# EAGLE design ATBS_Evaluation-Board (EAGLE 9.7.0)

## Sheet 1 of 4
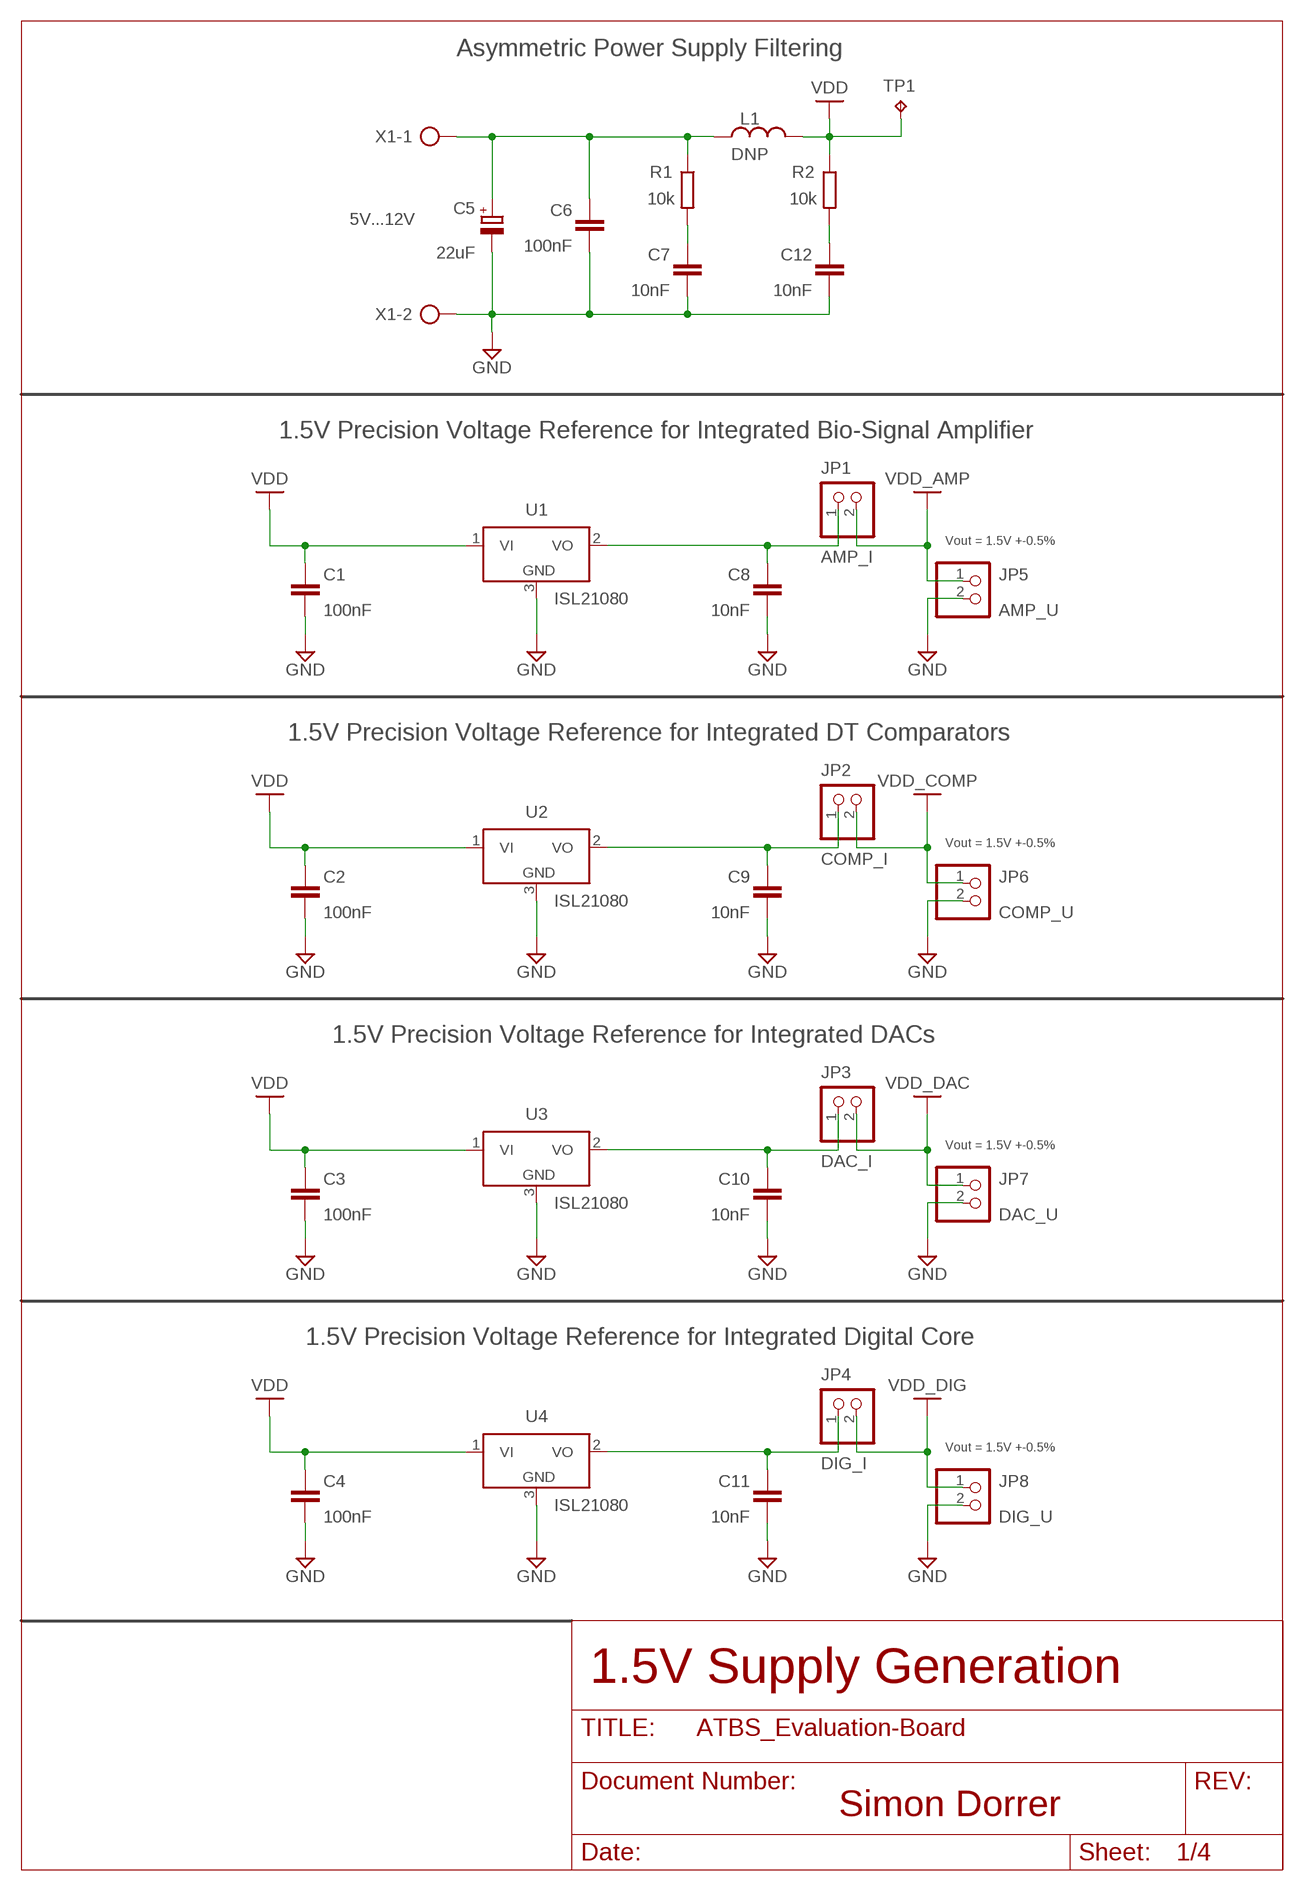
[diagram p0: schematic, sheet 1]

### Parts
C1  100nF  C_CHIP-0805(2012-METRIC)  [CAPC2012X110]
C2  100nF  C_CHIP-0805(2012-METRIC)  [CAPC2012X110]
C3  100nF  C_CHIP-0805(2012-METRIC)  [CAPC2012X110]
C4  100nF  C_CHIP-0805(2012-METRIC)  [CAPC2012X110]
C5  22uF  CPOL-EUSMCD  [SMC_D]
C6  100nF  C_CHIP-0805(2012-METRIC)  [CAPC2012X110]
C7  10nF  C_CHIP-0805(2012-METRIC)  [CAPC2012X110]
C8  10nF  C_CHIP-0805(2012-METRIC)  [CAPC2012X110]
C9  10nF  C_CHIP-0805(2012-METRIC)  [CAPC2012X110]
C10  10nF  C_CHIP-0805(2012-METRIC)  [CAPC2012X110]
C11  10nF  C_CHIP-0805(2012-METRIC)  [CAPC2012X110]
C12  10nF  C_CHIP-0805(2012-METRIC)  [CAPC2012X110]
JP1  AMP_I  PINHD-1X2  [1X02]
JP2  COMP_I  PINHD-1X2  [1X02]
JP3  DAC_I  PINHD-1X2  [1X02]
JP4  DIG_I  PINHD-1X2  [1X02]
JP5  AMP_U  PINHD-1X2  [1X02]
JP6  COMP_U  PINHD-1X2  [1X02]
JP7  DAC_U  PINHD-1X2  [1X02]
JP8  DIG_U  PINHD-1X2  [1X02]
L1  DNP  L_MOLDED(5450-METRIC)  [INDM5450X580]
R1  10k  R_CHIP-0805(2012-METRIC)  [RESC2012X65]
R2  10k  R_CHIP-0805(2012-METRIC)  [RESC2012X65]
TP1  TPPAD1-13  [P1-13]
U1  ISL21080  [SOT-23]
U2  ISL21080  [SOT-23]
U3  ISL21080  [SOT-23]
U4  ISL21080  [SOT-23]
X1  5V...12V  AK500/2  [AK500/2]

### Nets
GND: C1.2 C2.2 C3.2 C4.2 C5.- C6.2 C7.2 C8.2 C9.2 C10.2 C11.2 C12.2 JP5.2 JP6.2 JP7.2 JP8.2 U1.3(GND) U2.3(GND) U3.3(GND) U4.3(GND) X1.2 ; also sheet 2,3,4
N$1: C9.1 JP2.1 U2.2(VO)
N$2: C10.1 JP3.1 U3.2(VO)
N$3: C11.1 JP4.1 U4.2(VO)
N$30: C12.1 R2.2
N$38: C7.1 R1.2
N$42: C8.1 JP1.1 U1.2(VO)
N$47: C5.+ C6.1 L1.1 R1.1 X1.1
VDD [Supply]: C1.1 C2.1 C3.1 C4.1 L1.2 R2.1 TP1.TP U1.1(VI) U2.1(VI) U3.1(VI) U4.1(VI) ; also sheet 2
VDD_AMP [Supply]: JP1.2 JP5.1 ; also sheet 4
VDD_COMP [Supply]: JP2.2 JP6.1 ; also sheet 4
VDD_DAC [Supply]: JP3.2 JP7.1 ; also sheet 4
VDD_DIG [Supply]: JP4.2 JP8.1 ; also sheet 4

### Notes on the sheet
- Asymmetric Power Supply Filtering
- 1.5V Precision Voltage Reference for Integrated Bio-Signal Amplifier
- Vout = 1.5V +-0.5%
- 1.5V Precision Voltage Reference for Integrated DT Comparators
- Vout = 1.5V +-0.5%
- 1.5V Precision Voltage Reference for Integrated DACs
- Vout = 1.5V +-0.5%
- 1.5V Precision Voltage Reference for Integrated Digital Core
- Vout = 1.5V +-0.5%
- 1.5V Supply Generation
- Simon Dorrer

## Sheet 2 of 4
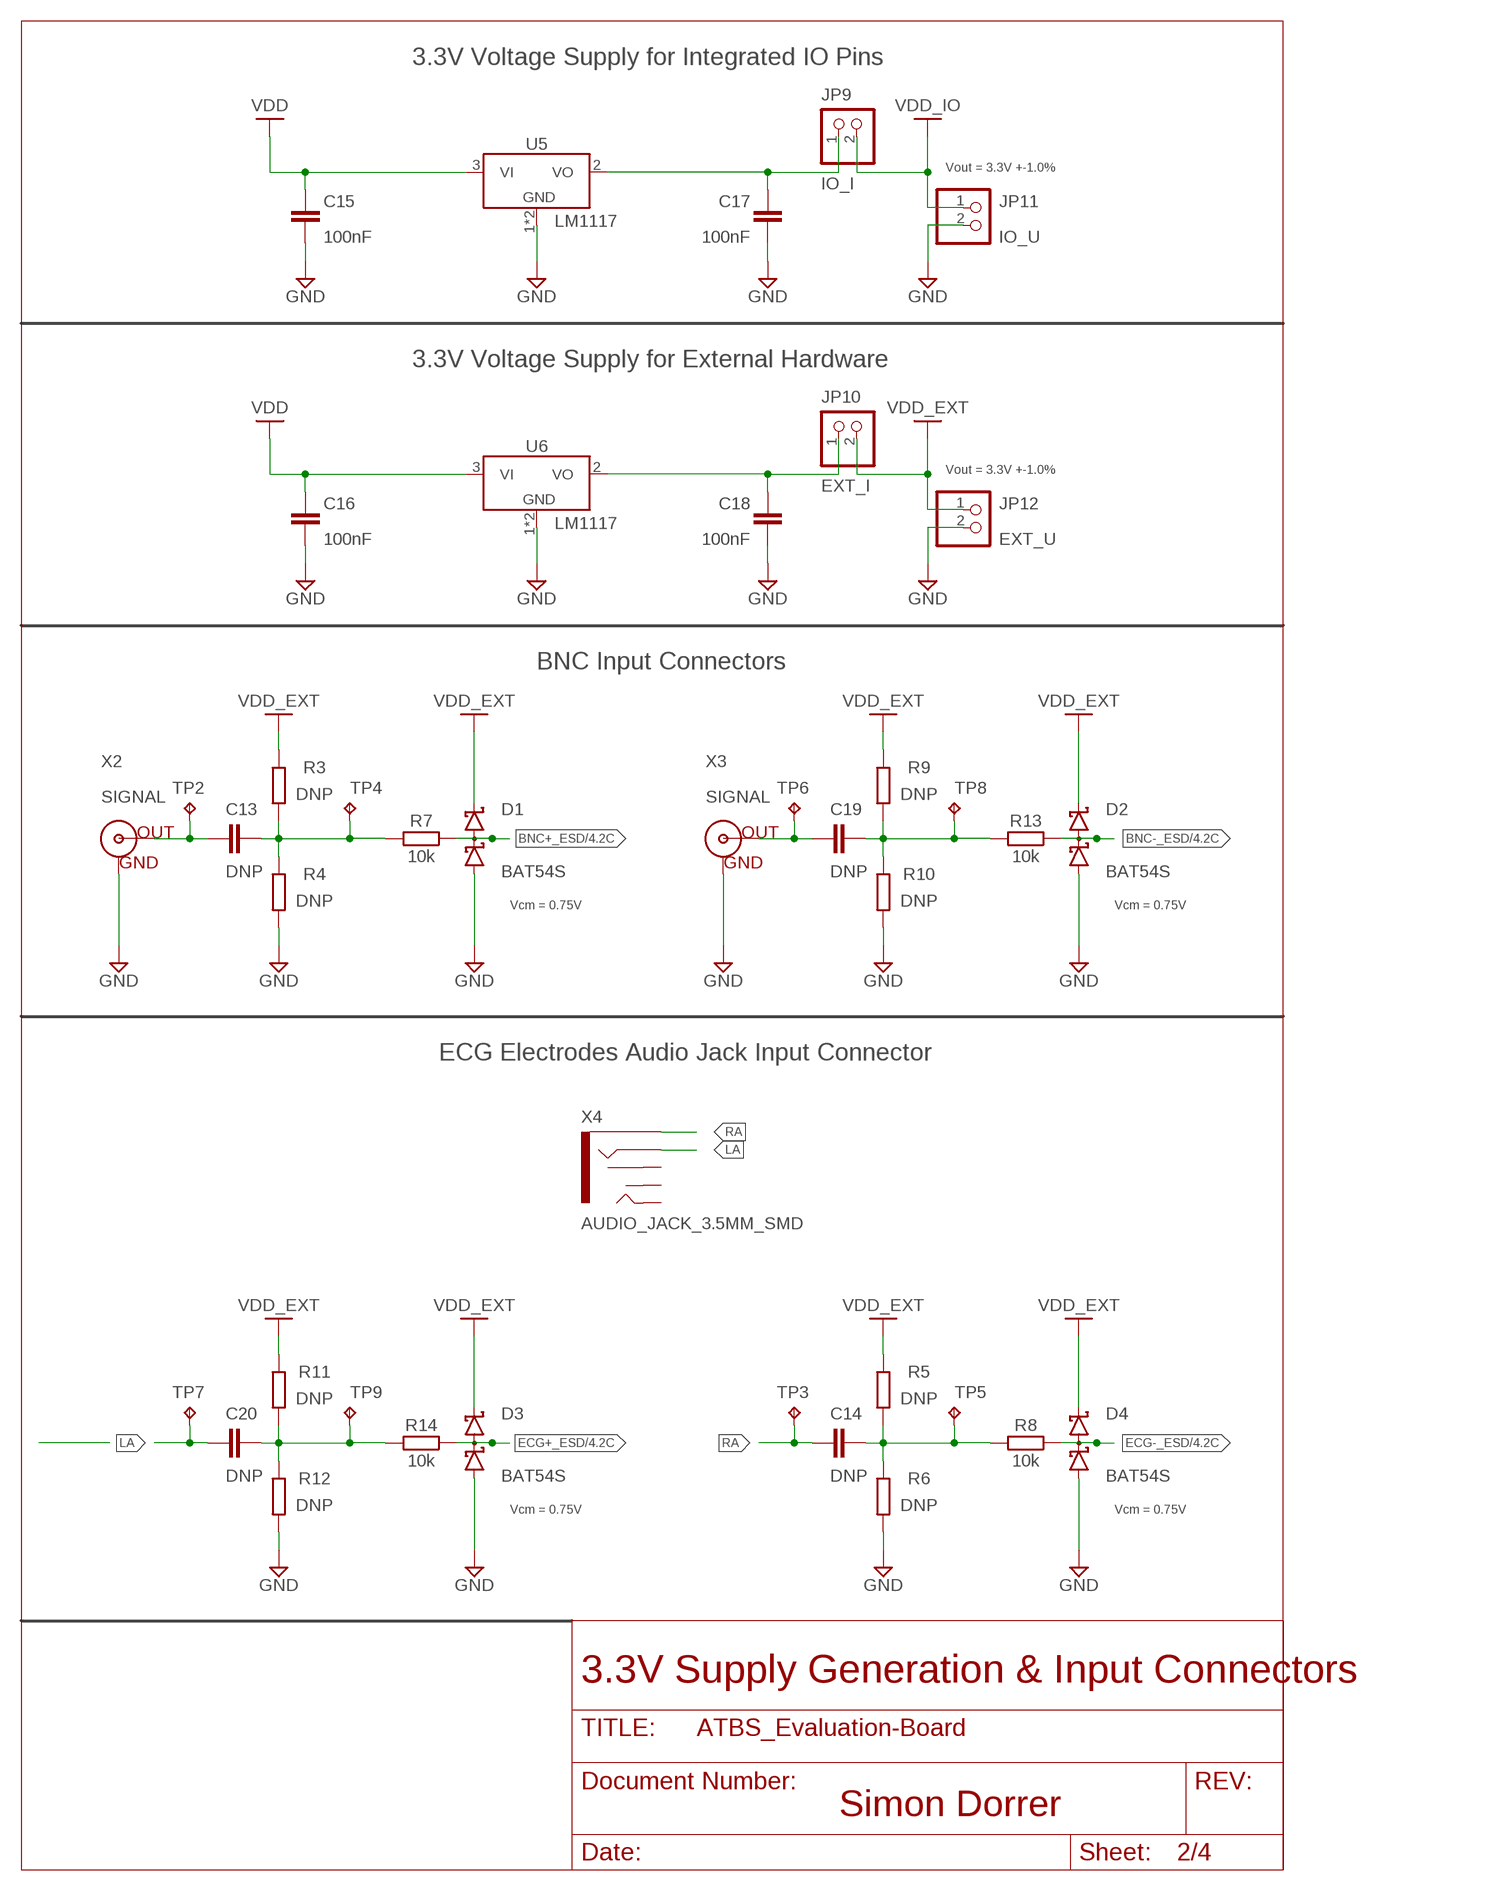
[diagram p1: schematic, sheet 2]

### Parts
C13  DNP  C_CHIP-0805(2012-METRIC)  [CAPC2012X110]
C14  DNP  C_CHIP-0805(2012-METRIC)  [CAPC2012X110]
C15  100nF  C_CHIP-0805(2012-METRIC)  [CAPC2012X110]
C16  100nF  C_CHIP-0805(2012-METRIC)  [CAPC2012X110]
C17  100nF  C_CHIP-0805(2012-METRIC)  [CAPC2012X110]
C18  100nF  C_CHIP-0805(2012-METRIC)  [CAPC2012X110]
C19  DNP  C_CHIP-0805(2012-METRIC)  [CAPC2012X110]
C20  DNP  C_CHIP-0805(2012-METRIC)  [CAPC2012X110]
D1  BAT54S  [SOT23]
D2  BAT54S  [SOT23]
D3  BAT54S  [SOT23]
D4  BAT54S  [SOT23]
JP9  IO_I  PINHD-1X2  [1X02]
JP10  EXT_I  PINHD-1X2  [1X02]
JP11  IO_U  PINHD-1X2  [1X02]
JP12  EXT_U  PINHD-1X2  [1X02]
R3  DNP  R_CHIP-0805(2012-METRIC)  [RESC2012X65]
R4  DNP  R_CHIP-0805(2012-METRIC)  [RESC2012X65]
R5  DNP  R_CHIP-0805(2012-METRIC)  [RESC2012X65]
R6  DNP  R_CHIP-0805(2012-METRIC)  [RESC2012X65]
R7  10k  R_CHIP-0805(2012-METRIC)  [RESC2012X65]
R8  10k  R_CHIP-0805(2012-METRIC)  [RESC2012X65]
R9  DNP  R_CHIP-0805(2012-METRIC)  [RESC2012X65]
R10  DNP  R_CHIP-0805(2012-METRIC)  [RESC2012X65]
R11  DNP  R_CHIP-0805(2012-METRIC)  [RESC2012X65]
R12  DNP  R_CHIP-0805(2012-METRIC)  [RESC2012X65]
R13  10k  R_CHIP-0805(2012-METRIC)  [RESC2012X65]
R14  10k  R_CHIP-0805(2012-METRIC)  [RESC2012X65]
TP2  TPPAD1-13  [P1-13]
TP3  TPPAD1-13  [P1-13]
TP4  TPPAD1-13  [P1-13]
TP5  TPPAD1-13  [P1-13]
TP6  TPPAD1-13  [P1-13]
TP7  TPPAD1-13  [P1-13]
TP8  TPPAD1-13  [P1-13]
TP9  TPPAD1-13  [P1-13]
U5  LM1117  LD1117_SOT223  [SOT230P700X170-4]
U6  LM1117  LD1117_SOT223  [SOT230P700X170-4]
X2  SIGNAL  BNCPTH  [BNC]
X3  SIGNAL  BNCPTH  [BNC]
X4  AUDIO_JACK_3.5MM_SMD  [AUDIO-JACK-3.5MM-SMD]

### Nets
BNC+_DC: C13.2 R3.2 R4.1 R7.2 TP4.TP
BNC+_ESD: D1.3(C1A2) R7.1 ; also sheet 4
BNC-_DC: C19.2 R9.2 R10.1 R13.2 TP8.TP
BNC-_ESD: D2.3(C1A2) R13.1 ; also sheet 4
ECG+_DC: C20.2 R11.2 R12.1 R14.2 TP9.TP
ECG+_ESD: D3.3(C1A2) R14.1 ; also sheet 4
ECG-_DC: C14.2 R5.2 R6.1 R8.2 TP5.TP
ECG-_ESD: D4.3(C1A2) R8.1 ; also sheet 4
GND: C15.2 C16.2 C17.2 C18.2 D1.1(A1) D2.1(A1) D3.1(A1) D4.1(A1) JP11.2 JP12.2 R4.2 R6.2 R10.2 R12.2 U5.1(GND) U5.4(GND) U6.1(GND) U6.4(GND) X2.GND X3.GND ; also sheet 1,3,4
LA: C20.1 TP7.TP X4.RING
N$4: C18.1 JP10.1 U6.2(VO)
N$5: C19.1 TP6.TP X3.S(OUT)
N$8: C17.1 JP9.1 U5.2(VO)
N$40: C13.1 TP2.TP X2.S(OUT)
RA: C14.1 TP3.TP X4.SLEEVE
VDD [Supply]: C15.1 C16.1 U5.3(VI) U6.3(VI) ; also sheet 1
VDD_EXT [Supply]: D1.2(C2) D2.2(C2) D3.2(C2) D4.2(C2) JP10.2 JP12.1 R3.1 R5.1 R9.1 R11.1 ; also sheet 3,4
VDD_IO [Supply]: JP9.2 JP11.1 ; also sheet 4
Unconnected: X4.RSH X4.TIP X4.TSH

### Notes on the sheet
- 3.3V Voltage Supply for Integrated IO Pins
- Vout = 3.3V +-1.0%
- 3.3V Voltage Supply for External Hardware
- Vout = 3.3V +-1.0%
- BNC Input Connectors
- Vcm = 0.75V | Vcm = 0.75V
- ECG Electrodes Audio Jack Input Connector
- Vcm = 0.75V | Vcm = 0.75V
- 3.3V Supply Generation & Input Connectors
- Simon Dorrer

## Sheet 3 of 4
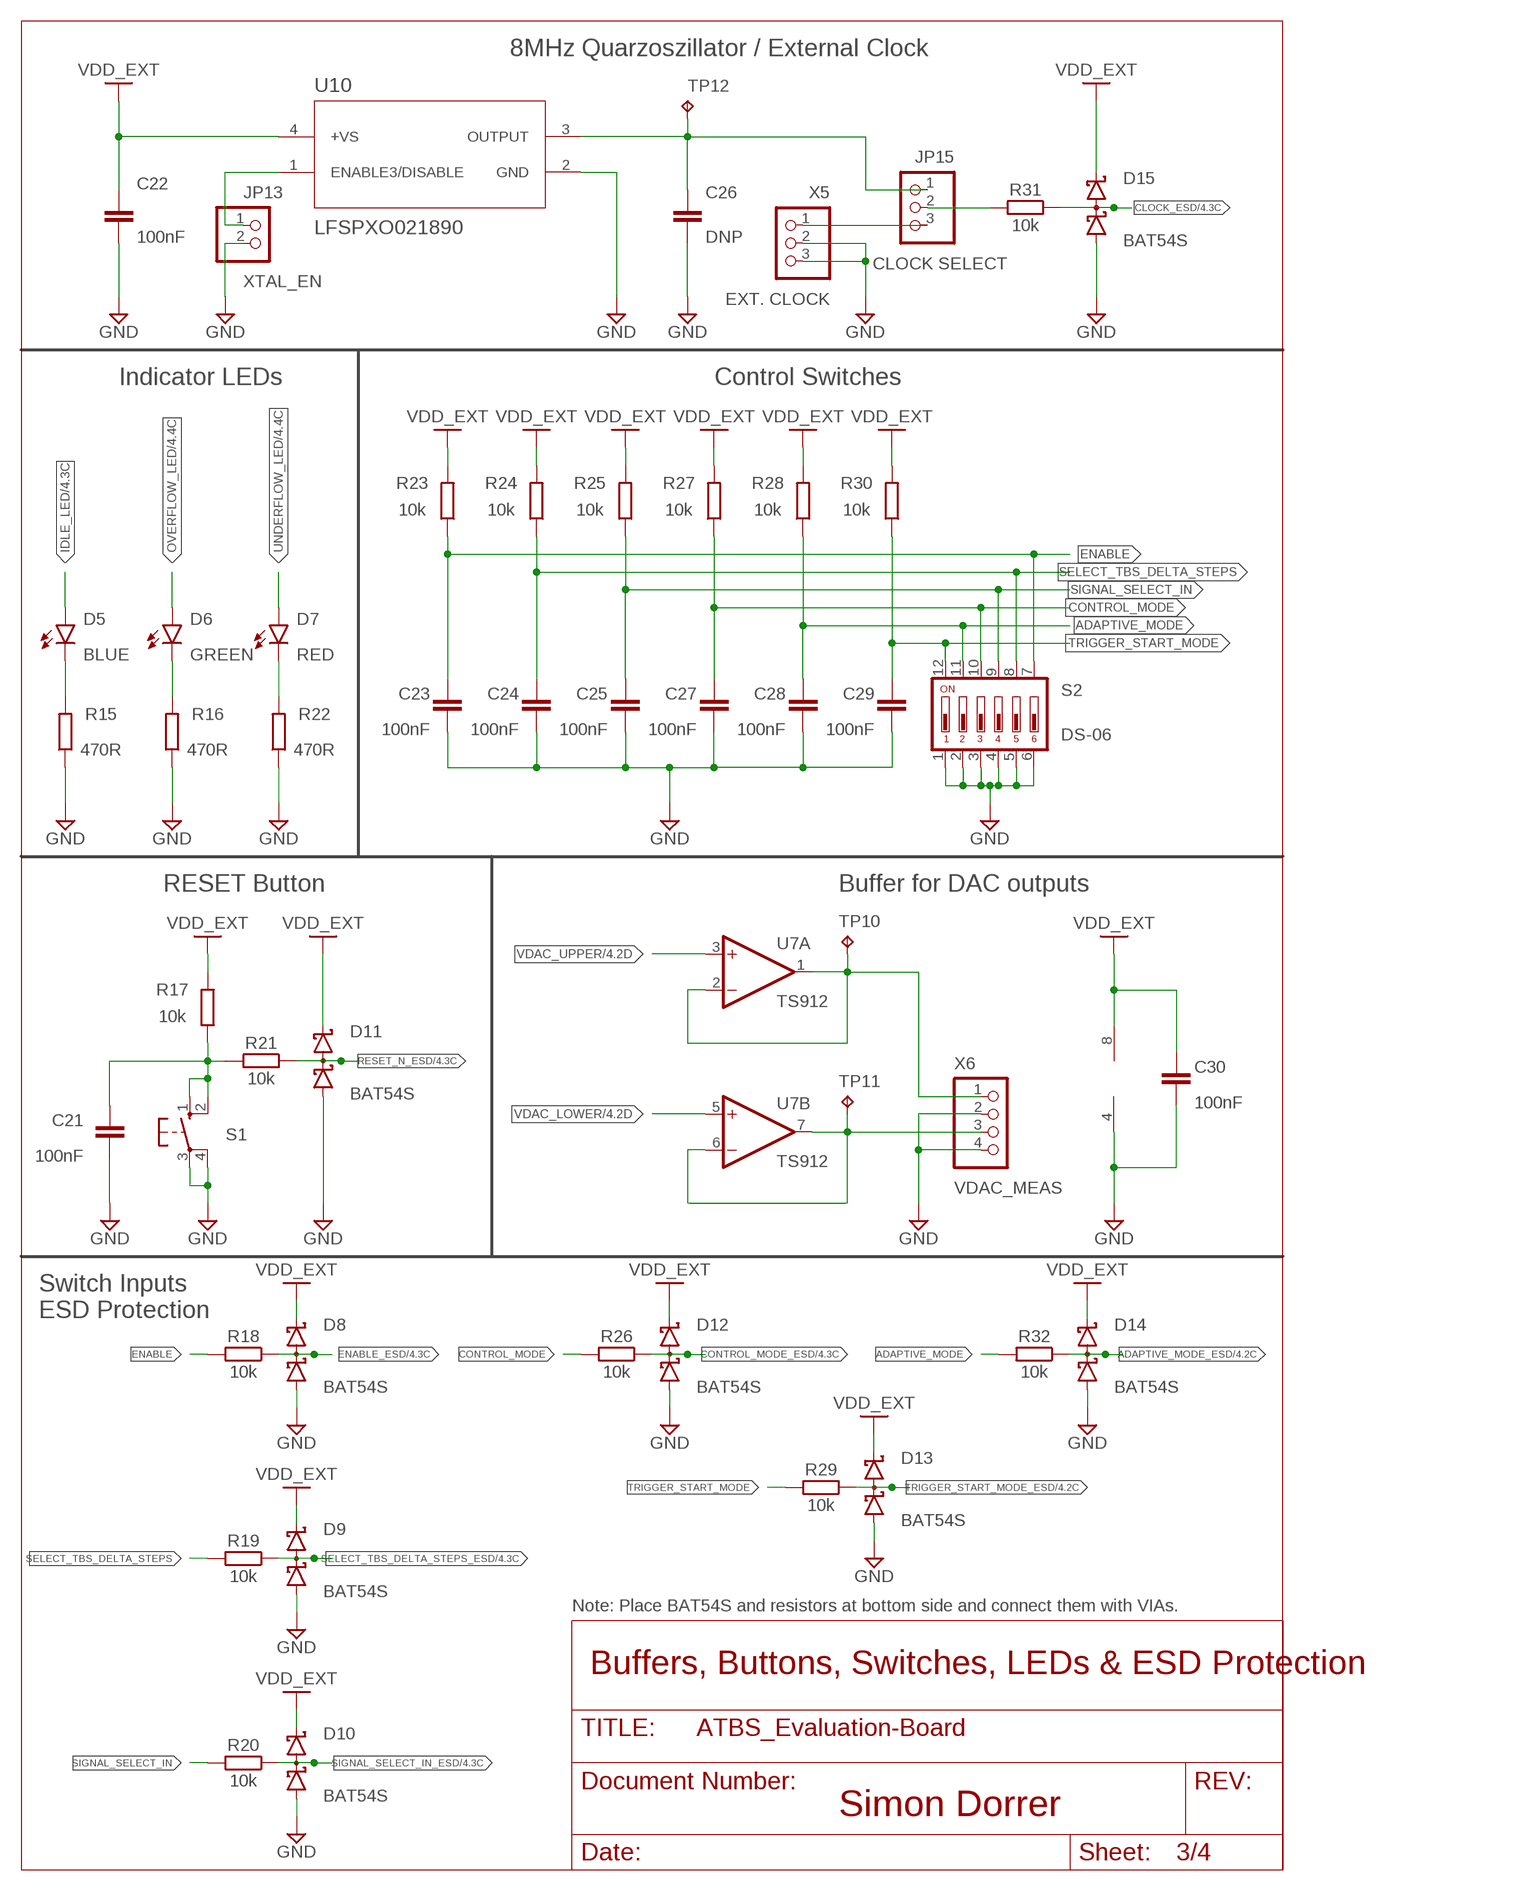
[diagram p2: schematic, sheet 3]

### Parts
C21  100nF  C_CHIP-0805(2012-METRIC)  [CAPC2012X110]
C22  100nF  C_CHIP-0805(2012-METRIC)  [CAPC2012X110]
C23  100nF  C_CHIP-0805(2012-METRIC)  [CAPC2012X110]
C24  100nF  C_CHIP-0805(2012-METRIC)  [CAPC2012X110]
C25  100nF  C_CHIP-0805(2012-METRIC)  [CAPC2012X110]
C26  DNP  C_CHIP-0805(2012-METRIC)  [CAPC2012X110]
C27  100nF  C_CHIP-0805(2012-METRIC)  [CAPC2012X110]
C28  100nF  C_CHIP-0805(2012-METRIC)  [CAPC2012X110]
C29  100nF  C_CHIP-0805(2012-METRIC)  [CAPC2012X110]
C30  100nF  C_CHIP-0805(2012-METRIC)  [CAPC2012X110]
D5  BLUE  CHIP-FLAT-B_0805  [LEDC2012X110N_FLAT-B]
D6  GREEN  CHIP-FLAT-G_0805  [LEDC2012X110N_FLAT-G]
D7  RED  CHIP-FLAT-R_0805  [LEDC2012X110N_FLAT-R]
D8  BAT54S  [SOT23]
D9  BAT54S  [SOT23]
D10  BAT54S  [SOT23]
D11  BAT54S  [SOT23]
D12  BAT54S  [SOT23]
D13  BAT54S  [SOT23]
D14  BAT54S  [SOT23]
D15  BAT54S  [SOT23]
JP13  XTAL_EN  PINHD-1X2  [1X02]
JP15  CLOCK SELECT  PINHD-1X3  [1X03]
R15  470R  R_CHIP-0805(2012-METRIC)  [RESC2012X65]
R16  470R  R_CHIP-0805(2012-METRIC)  [RESC2012X65]
R17  10k  R_CHIP-0805(2012-METRIC)  [RESC2012X65]
R18  10k  R_CHIP-0805(2012-METRIC)  [RESC2012X65]
R19  10k  R_CHIP-0805(2012-METRIC)  [RESC2012X65]
R20  10k  R_CHIP-0805(2012-METRIC)  [RESC2012X65]
R21  10k  R_CHIP-0805(2012-METRIC)  [RESC2012X65]
R22  470R  R_CHIP-0805(2012-METRIC)  [RESC2012X65]
R23  10k  R_CHIP-0805(2012-METRIC)  [RESC2012X65]
R24  10k  R_CHIP-0805(2012-METRIC)  [RESC2012X65]
R25  10k  R_CHIP-0805(2012-METRIC)  [RESC2012X65]
R26  10k  R_CHIP-0805(2012-METRIC)  [RESC2012X65]
R27  10k  R_CHIP-0805(2012-METRIC)  [RESC2012X65]
R28  10k  R_CHIP-0805(2012-METRIC)  [RESC2012X65]
R29  10k  R_CHIP-0805(2012-METRIC)  [RESC2012X65]
R30  10k  R_CHIP-0805(2012-METRIC)  [RESC2012X65]
R31  10k  R_CHIP-0805(2012-METRIC)  [RESC2012X65]
R32  10k  R_CHIP-0805(2012-METRIC)  [RESC2012X65]
S1  10-XX  [B3F-10XX]
S2  DS-06  DS06  [DS-06]
TP10  TPPAD1-13  [P1-13]
TP11  TPPAD1-13  [P1-13]
TP12  TPPAD1-13  [P1-13]
U7  TS912  2AMP_P8+4D  [SO08]
U10  LFSPXO021890  LFSPXO009682REEL  [LFSPXO009682REEL_IQD]
X5  EXT. CLOCK  PINHD-1X3  [1X03]
X6  VDAC_MEAS  PINHD-1X4  [1X04]

### Nets
ADAPTIVE_MODE: C28.1 R28.1 R32.2 S2.11
ADAPTIVE_MODE_ESD: D14.3(C1A2) R32.1 ; also sheet 4
CLOCK_ESD: D15.3(C1A2) R31.1 ; also sheet 4
CONTROL_MODE: C27.1 R26.2 R27.1 S2.10
CONTROL_MODE_ESD: D12.3(C1A2) R26.1 ; also sheet 4
ENABLE: C23.1 R18.2 R23.1 S2.7
ENABLE_ESD: D8.3(C1A2) R18.1 ; also sheet 4
GND: C21.2 C22.2 C23.2 C24.2 C25.2 C26.2 C27.2 C28.2 C29.2 C30.2 D8.1(A1) D9.1(A1) D10.1(A1) D11.1(A1) D12.1(A1) D13.1(A1) D14.1(A1) D15.1(A1) JP13.2 R15.1 R16.1 R22.1 S1.3(P) S1.4(P1) S2.1 S2.2 S2.3 S2.4 S2.5 S2.6 U7.4(P:V-) U10.2(GND) X5.2 X5.3 X6.2 X6.4 ; also sheet 1,2,4
IDLE_LED: D5.A ; also sheet 4
LOWER: TP11.TP U7.6(B:-IN) U7.7(B:OUT) X6.3
N$10: JP15.3 X5.1
N$13: JP15.2 R31.2
N$39: JP13.1 U10.1(ENABLE3/DISABLE)
N$43: C26.1 JP15.1 TP12.TP U10.3(OUTPUT)
N$51: D5.C R15.2
N$52: D6.C R16.2
N$54: D7.C R22.2
OVERFLOW_LED: D6.A ; also sheet 4
RESET_N: C21.1 R17.1 R21.2 S1.1(S) S1.2(S1)
RESET_N_ESD: D11.3(C1A2) R21.1 ; also sheet 4
SELECT_TBS_DELTA_STEPS: C24.1 R19.2 R24.1 S2.8
SELECT_TBS_DELTA_STEPS_ESD: D9.3(C1A2) R19.1 ; also sheet 4
SIGNAL_SELECT_IN: C25.1 R20.2 R25.1 S2.9
SIGNAL_SELECT_IN_ESD: D10.3(C1A2) R20.1 ; also sheet 4
TRIGGER_START_MODE: C29.1 R29.2 R30.1 S2.12
TRIGGER_START_MODE_ESD: D13.3(C1A2) R29.1 ; also sheet 4
UNDERFLOW_LED: D7.A ; also sheet 4
UPPER: TP10.TP U7.1(A:OUT) U7.2(A:-IN) X6.1
VDAC_LOWER: U7.5(B:+IN) ; also sheet 4
VDAC_UPPER: U7.3(A:+IN) ; also sheet 4
VDD_EXT [Supply]: C22.1 C30.1 D8.2(C2) D9.2(C2) D10.2(C2) D11.2(C2) D12.2(C2) D13.2(C2) D14.2(C2) D15.2(C2) R17.2 R23.2 R24.2 R25.2 R27.2 R28.2 R30.2 U7.8(P:V+) U10.4(+VS) ; also sheet 2,4

### Notes on the sheet
- 8MHz Quarzoszillator / External Clock
- Indicator LEDs | Control Switches
- RESET Button | Buffer for DAC outputs
- Switch Inputs 
  ESD Protection
- Note: Place BAT54S and resistors at bottom side and connect them with VIAs.
- Buffers, Buttons, Switches, LEDs & ESD Protection
- Simon Dorrer

## Sheet 4 of 4
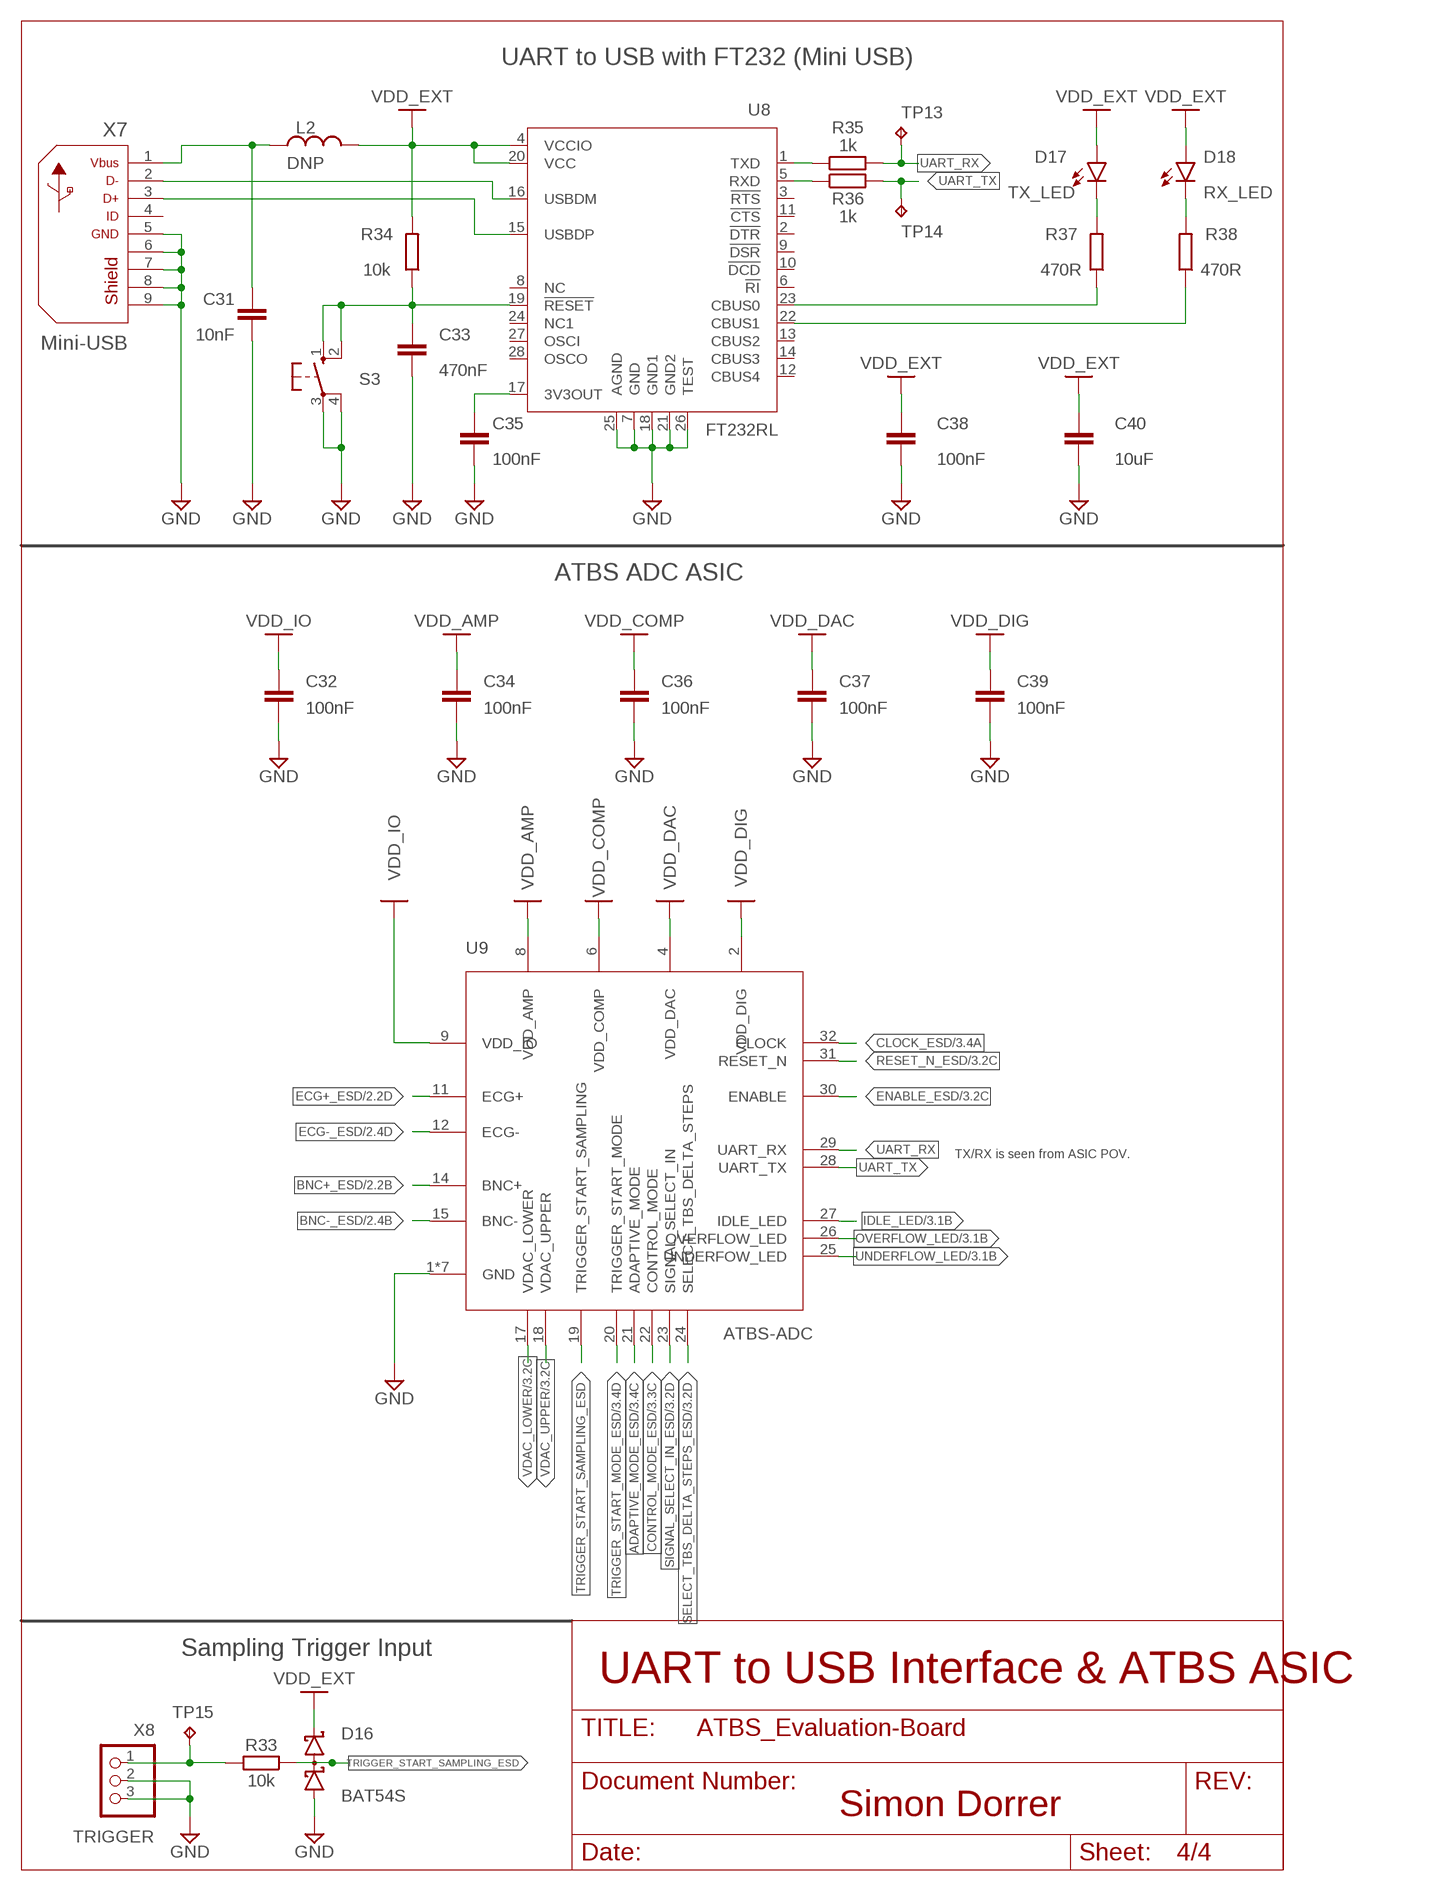
[diagram p3: schematic, sheet 4]

### Parts
C31  10nF  C_CHIP-0805(2012-METRIC)  [CAPC2012X110]
C32  100nF  C_CHIP-0603(1608-METRIC)  [CAPC1608X85]
C33  470nF  C_CHIP-0805(2012-METRIC)  [CAPC2012X110]
C34  100nF  C_CHIP-0603(1608-METRIC)  [CAPC1608X85]
C35  100nF  C_CHIP-0805(2012-METRIC)  [CAPC2012X110]
C36  100nF  C_CHIP-0603(1608-METRIC)  [CAPC1608X85]
C37  100nF  C_CHIP-0603(1608-METRIC)  [CAPC1608X85]
C38  100nF  C_CHIP-0805(2012-METRIC)  [CAPC2012X110]
C39  100nF  C_CHIP-0603(1608-METRIC)  [CAPC1608X85]
C40  10uF  C_CHIP-0805(2012-METRIC)  [CAPC2012X110]
D16  BAT54S  [SOT23]
D17  TX_LED  CHIP-FLAT-B_0805  [LEDC2012X110N_FLAT-B]
D18  RX_LED  CHIP-FLAT-G_0805  [LEDC2012X110N_FLAT-G]
L2  DNP  L_CHIP-0805(2012-METRIC)  [INDC2009X120]
R33  10k  R_CHIP-0805(2012-METRIC)  [RESC2012X65]
R34  10k  R_CHIP-0805(2012-METRIC)  [RESC2012X65]
R35  1k  R_CHIP-0805(2012-METRIC)  [RESC2012X65]
R36  1k  R_CHIP-0805(2012-METRIC)  [RESC2012X65]
R37  470R  R_CHIP-0805(2012-METRIC)  [RESC2012X65]
R38  470R  R_CHIP-0805(2012-METRIC)  [RESC2012X65]
S3  10-XX  [B3F-10XX]
TP13  TPPAD1-13  [P1-13]
TP14  TPPAD1-13  [P1-13]
TP15  TPPAD1-13  [P1-13]
U8  FT232RL  FT232RL_SSOP  [SSOP28]
U9  ATBS-ADC  [ATBS-ADC]
X7  Mini-USB  1734035-4  [CONN5_USB1734035_TEC]
X8  TRIGGER  PINHD-1X3  [1X03]

### Nets
ADAPTIVE_MODE_ESD: U9.21(ADAPTIVE_MODE) ; also sheet 3
BNC+_ESD: U9.14(BNC+) ; also sheet 2
BNC-_ESD: U9.15(BNC-) ; also sheet 2
CLOCK_ESD: U9.32(CLOCK) ; also sheet 3
CONTROL_MODE_ESD: U9.22(CONTROL_MODE) ; also sheet 3
ECG+_ESD: U9.11(ECG+) ; also sheet 2
ECG-_ESD: U9.12(ECG-) ; also sheet 2
ENABLE_ESD: U9.30(ENABLE) ; also sheet 3
GND: C31.2 C32.2 C33.2 C34.2 C35.2 C36.2 C37.2 C38.2 C39.2 C40.2 D16.1(A1) S3.3(P) S3.4(P1) U8.7(GND) U8.18(GND1) U8.21(GND2) U8.25(AGND) U8.26(TEST) U9.1(GND) U9.3(GND) U9.5(GND) U9.7(GND) U9.10(GND) U9.13(GND) U9.16(GND) X7.5 X7.6 X7.7 X7.8 X7.9 X8.2 X8.3 ; also sheet 1,2,3
IDLE_LED: U9.27(IDLE_LED) ; also sheet 3
N$6: D17.C R37.2
N$7: D18.C R38.2
N$9: C31.1 L2.1 X7.1
N$11: C33.1 R34.1 S3.1(S) S3.2(S1) U8.19(!RESET)
N$55: R35.1 U8.1(TXD)
N$63: R36.1 U8.5(RXD)
N$67: C35.1 U8.17(3V3OUT)
N$70: R37.1 U8.23(CBUS0)
N$71: U8.16(USBDM) X7.2
N$72: U8.15(USBDP) X7.3
N$75: R38.1 U8.22(CBUS1)
OVERFLOW_LED: U9.26(OVERFLOW_LED) ; also sheet 3
RESET_N_ESD: U9.31(RESET_N) ; also sheet 3
SELECT_TBS_DELTA_STEPS_ESD: U9.24(SELECT_TBS_DELTA_STEPS) ; also sheet 3
SIGNAL_SELECT_IN_ESD: U9.23(SIGNAL_SELECT_IN) ; also sheet 3
TRIGGER_START_MODE_ESD: U9.20(TRIGGER_START_MODE) ; also sheet 3
TRIGGER_START_SAMPLING: R33.2 TP15.TP X8.1
TRIGGER_START_SAMPLING_ESD: D16.3(C1A2) R33.1 U9.19(TRIGGER_START_SAMPLING)
UART_RX: R35.2 TP13.TP U9.29(UART_RX)
UART_TX: R36.2 TP14.TP U9.28(UART_TX)
UNDERFLOW_LED: U9.25(UNDERFOW_LED) ; also sheet 3
VDAC_LOWER: U9.17(VDAC_LOWER) ; also sheet 3
VDAC_UPPER: U9.18(VDAC_UPPER) ; also sheet 3
VDD_AMP [Supply]: C34.1 U9.8(VDD_AMP) ; also sheet 1
VDD_COMP [Supply]: C36.1 U9.6(VDD_COMP) ; also sheet 1
VDD_DAC [Supply]: C37.1 U9.4(VDD_DAC) ; also sheet 1
VDD_DIG [Supply]: C39.1 U9.2(VDD_DIG) ; also sheet 1
VDD_EXT [Supply]: C38.1 C40.1 D16.2(C2) D17.A D18.A L2.2 R34.2 U8.4(VCCIO) U8.20(VCC) ; also sheet 2,3
VDD_IO [Supply]: C32.1 U9.9(VDD_IO) ; also sheet 2
Unconnected: U8.2(!DTR) U8.3(!RTS) U8.6(!RI) U8.8(NC) U8.9(!DSR) U8.10(!DCD) U8.11(!CTS) U8.12(CBUS4) U8.13(CBUS2) U8.14(CBUS3) U8.24(NC1) U8.27(OSCI) U8.28(OSCO) X7.4

### Notes on the sheet
- UART to USB with FT232 (Mini USB)
- ATBS ADC ASIC
- TX/RX is seen from ASIC POV.
- Sampling Trigger Input
- UART to USB Interface & ATBS ASIC
- Simon Dorrer

## Library data of the parts
C1-C4 C6-C40 = Capacitor:C: Capacitor - Generic; CATEGORY: Capacitor
C5 = rcl:CPOL-EU: POLARIZED CAPACITOR, European symbol; SPICEPREFIX: C
D1-D4 D8-D16 = diode:BAT54S: Schottky Diodes Pin connection corrected 2011-05-04 Source: Fairchild .. BAT54.pdf
D5 D17 = LED:CHIP-FLAT-B; CATEGORY: LED; COLOR: BLUE; DESCRIPTION: CHIP LED FLAT; SUB-CATEGORY: CHIP; TYPE: FLAT_TOP; VALUE: LED_BLUE
D6 D18 = LED:CHIP-FLAT-G; CATEGORY: LED; COLOR: GREEN; DESCRIPTION: CHIP LED FLAT; SUB-CATEGORY: CHIP; TYPE: FLAT_TOP; VALUE: LED_GREEN
D7 = LED:CHIP-FLAT-R; CATEGORY: LED; COLOR: RED; DESCRIPTION: CHIP LED FLAT; SUB-CATEGORY: CHIP; TYPE: FLAT_TOP; VALUE: LED_RED
JP1-JP13 = Connector:PINHD-1X2: PIN HEADER; CATEGORY: Headers; DESCRIPTION: Header-Straight-2 Position; PACKAGE_TYPE: THT; PITCH: 0.100" (2.54mm); SUBCATEGORY: Headers-Male Pins; TYPE: Board to Board or Cable-Unshrouded-Through Hole-Straight
JP15 X5 X8 = pinhead:PINHD-1X3: PIN HEADER
L1 L2 = Inductor:L: Inductor Fixed - Generic; CATEGORY: Inductor; SUB-CATEGORY: Fixed
R1-R38 = Resistor:R: Resistor Fixed - Generic; CATEGORY: Resistor; SUB-CATEGORY: Fixed
S1 S3 = switch-omron:10-XX: OMRON SWITCH; MPN: B3F-1000; OC_FARNELL: 176432; OC_NEWARK: 36M3542
S2 = Switch:DS06: DIL/CODE SWITCH; CATEGORY: SWITCH; MPN: MCNDS-06-V; TYPE: SPST
TP1-TP15 = testpad:TP: Test pad
U1-U4 = ISL21080:ISL21080
U5 U6 = IC_Power-Management:LD1117: Adjustable and fixed positive voltage regulator Reference Datasheet <https://www.st.com/content/ccc/resource/technical/document/datasheet/99/3b/7d/91/91/51/4b/be/CD00000544.pdf/files/CD00000544.pdf/jcr:content/translations/en.CD00000544.pdf>; CATEGORY: IC_Linear; DESCRIPTION: Adjustable voltage regulator; MANUFACTURER: STMicroelectronics; MPN: Generic; SERIES: LM1117; SUB-CATEGORY: Voltage Regulator; TYPE: Linear
U7 = linear:2AMP_P8+4: OP AMP
U8 = IC_Interface:FT232RL: USB Bridge, USB to UART USB 2.0 UART Interface Datasheet <https://www.ftdichip.com/Support/Documents/DataSheets/ICs/DS_FT232R.pdf>; CATEGORY: IC_Interface; MANUFACTURER: FTDI Chip; MPN: FT232RL; OPERATING_TEMP: -40 to 85°C; PART_STATUS: Active; ROHS_COMPLIANT: Compliant; SUB-CATEGORY: Controller; THERMALLOSS: 0.5W; TYPE: USB to UART
U9 = ATBS-ADC:ATBS-ADC
U10 = CFPS-73:LFSPXO009682REEL; COPYRIGHT: Copyright (C) 2024 Ultra Librarian. All rights reserved.; MANUFACTURER_PART_NUMBER: LFSPXO009682REEL; MFR_NAME: IQD Frequency Products
X1 = con-ptr500:AK500/2: CONNECTOR; OC_FARNELL: unknown; OC_NEWARK: unknown
X2 X3 = SparkFun-Connectors:BNC: BNC Right Angle Connector Mouser Part# 5227161 SparkFun Products: BNC Connector - Right Angle <https://www.sparkfun.com/products/10550>; PROD_ID: LPA-12729; SF_ID: PRT-10550
X4 = SparkFun-Connectors:AUDIO_JACK_3.5MM: Audio Jack 3.5mm variants of PTH and SMT stereo audio jack with bypass switches. SparkFun Products: SparkFun SparkPunk Sound Kit <[https://www.sparkfun.com/products/11177]> - PTH MP3 Trigger <https://www.sparkfun.com/products/13720> -3.5mm SMD SparkFun PicoBoard <https://www.sparkfun.com/products/11888>- 2.5mm SMD; PROD_ID: CONN-10353
X6 = pinhead:PINHD-1X4: PIN HEADER
X7 = USB_mini:1734035-4; COPYRIGHT: Copyright (C) 2024 Ultra Librarian. All rights reserved.; MANUFACTURER_PART_NUMBER: 1734035-4; MFR_NAME: TE Connectivity; TYPE: USB 2.0

## Net classes
1 Supply: width 0.4 mm

## Board
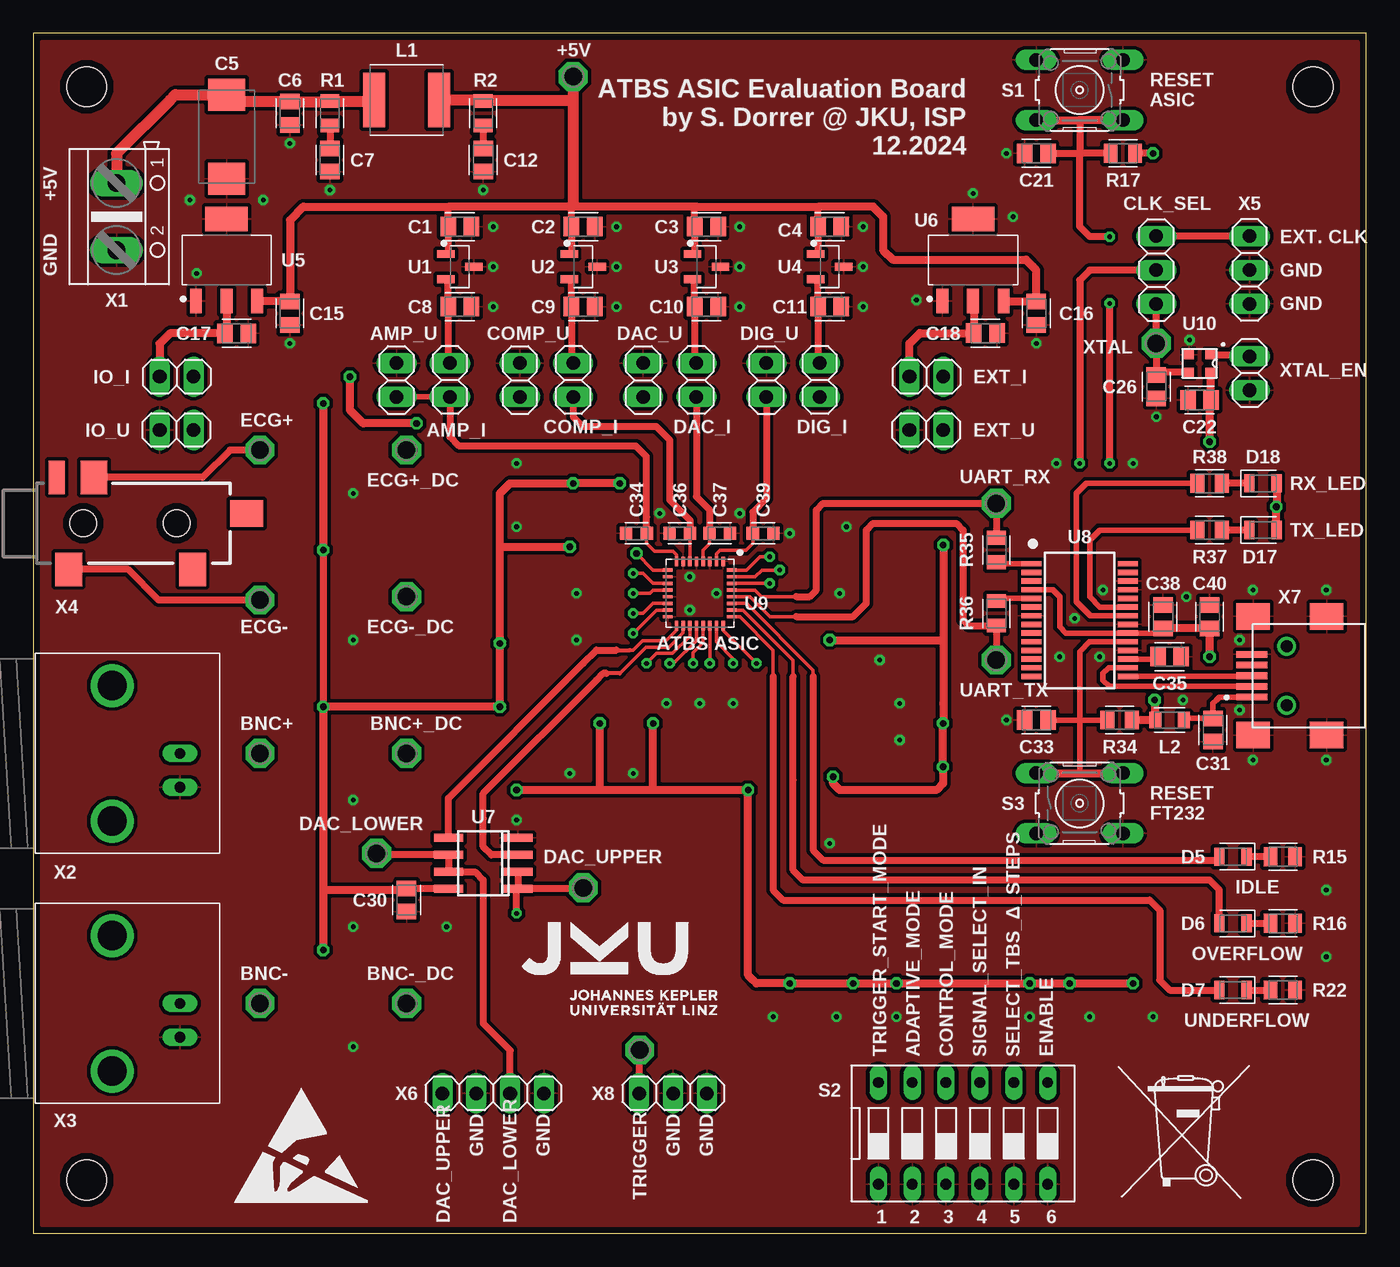
[diagram p4: board, top side]
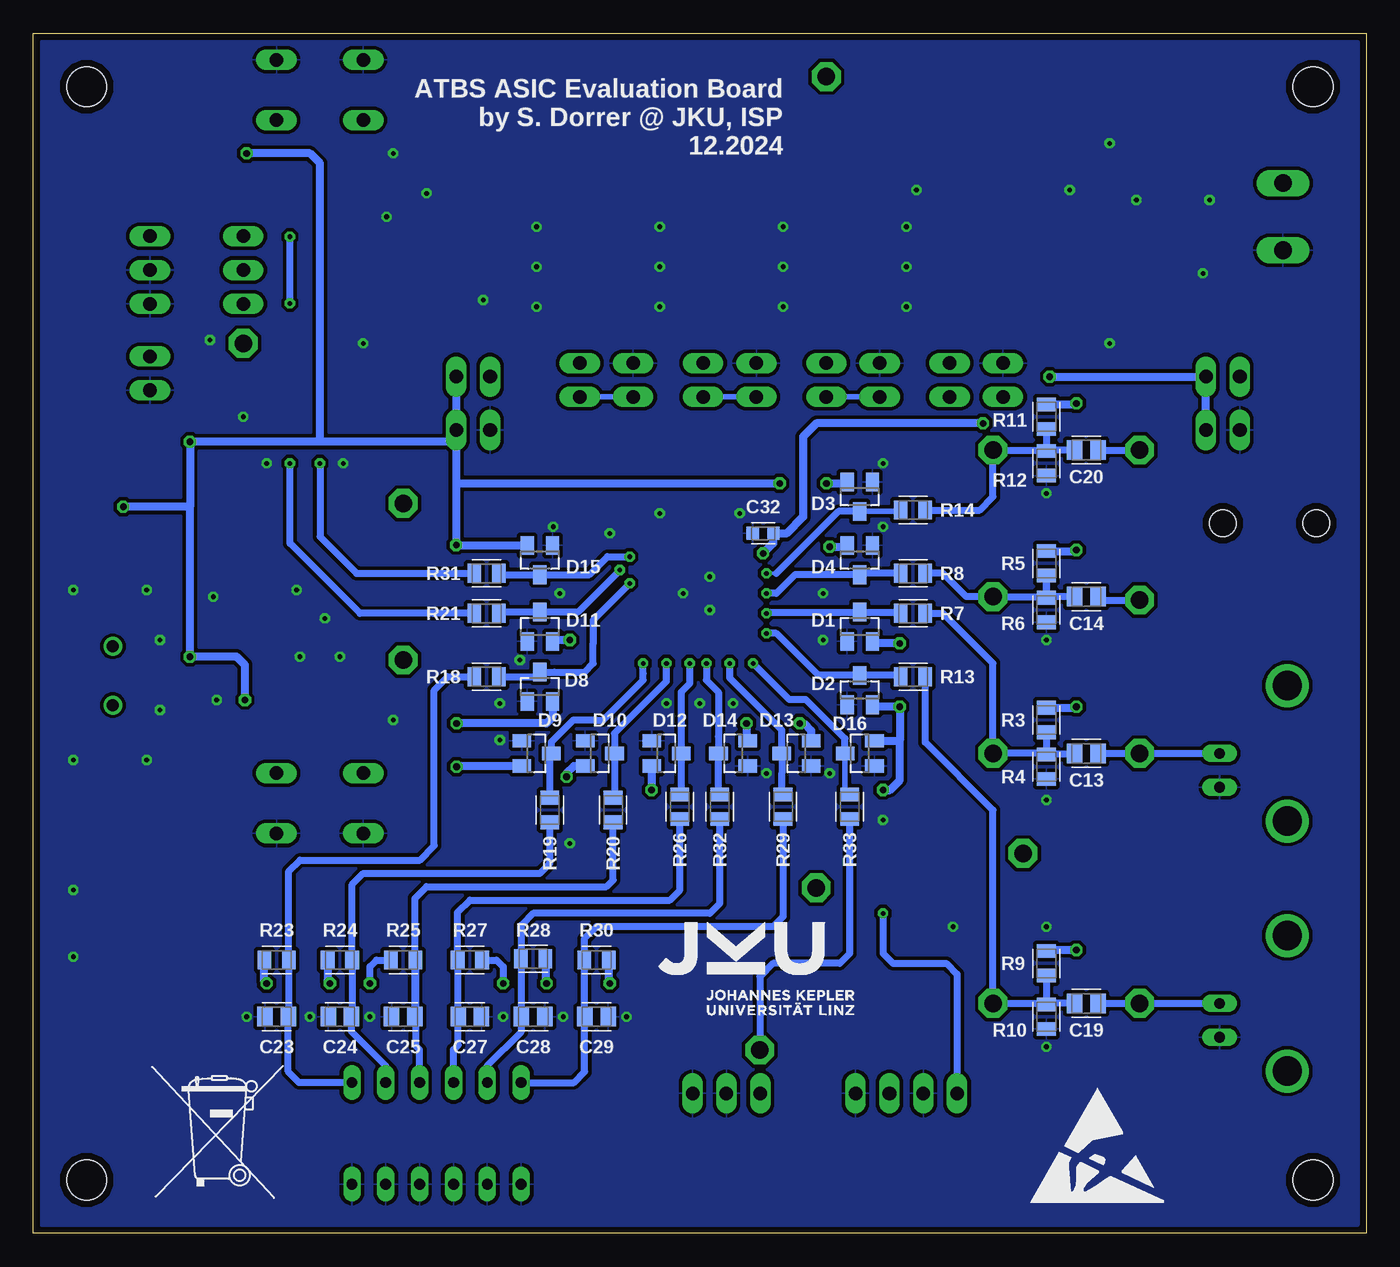
[diagram p5: board, bottom side, seen from below]

Size 100 x 90 mm. Coordinates in mm from the lower left corner, seen from the top.
Outline: 0,0 100,0 100,90 0,90 0,0
Copper layers (1*16): Top / Bottom
Stack-up Default Layer Stack: Top User Defined 0.035mm / Dielectric-1 User Defined 1.5mm / Bottom User Defined 0.035mm
Design rules: minimum copper width classes=1 0.4mm, minimum copper width 0.2mm, minimum drill size 0.35mm, copper clearance wire_polygon to wire_polygon 0.2mm, copper clearance wire_polygon to pad_smd 0.2mm, copper clearance wire_polygon to via 0.2mm, copper clearance pad_smd to pad_smd 0.2mm, copper clearance pad_smd to via 0.2mm, copper clearance via to via 0.2mm, copper clearance smd to pad (same net) 0.2mm, copper clearance smd to via (same net) 0.2mm, copper clearance smd to smd (same net) 0.2mm, dimension clearance 0.5mm, via restrict clearance 0mil, restrict clearance 0mil, drill distance 6mil, keepout clearance 0mil
Holes 3 mm at 4,4 4,86 96,4 96,86

### Footprints (pad centres in the part's own frame; a part is rotated, then mirrored left to right if it is on the bottom)
CAPC2012X110 = smd 1.165 x 1.465: 1 -0.875,0; 2 0.875,0
SMC_D = smd 2.4 x 2.8: + -3.15,0; - 3.15,0
CAPC1608X85 = smd 0.921 x 0.97: 1 -0.775,0; 2 0.775,0
SOT23 = smd 1 x 1.4: 1 -0.95,-1.1; 2 0.95,-1.1; 3 0,1.1
LEDC2012X110N_FLAT-B = smd 0.762 x 1.362: A 1.025,0; C -1.025,0
LEDC2012X110N_FLAT-G = smd 0.762 x 1.362: A 1.025,0; C -1.025,0
LEDC2012X110N_FLAT-R = smd 0.762 x 1.362: A 1.025,0; C -1.025,0
1X02 = drill 1.016 long: 1 -1.27,0; 2 1.27,0
1X03 = drill 1.016 long: 1 -2.54,0; 2 0,0; 3 2.54,0
INDM5450X580 = smd 1.653 x 4.115: 1 -2.438,0; 2 2.438,0
INDC2009X120 = smd 0.876 x 1.21: 1 -1.067,0; 2 1.067,0
RESC2012X65 = smd 1.031 x 1.42: 1 -0.919,0; 2 0.919,0
B3F-10XX = drill 1.016 long: 1 -3.251,2.261; 2 3.251,2.261; 3 -3.251,-2.261; 4 3.251,-2.261
DS-06 = drill 0.813 long: 1 -6.35,-3.81; 2 -3.81,-3.81; 3 -1.27,-3.81; 4 1.27,-3.81; 5 3.81,-3.81; 6 6.35,-3.81; 7 6.35,3.81; 8 3.81,3.81; 9 1.27,3.81; 10 -1.27,3.81; 11 -3.81,3.81; 12 -6.35,3.81
P1-13 = drill 1.321 pad 2.159 octagon: TP 0,0
SOT-23 = smd 1.3 x 0.6: 1 -1.05,0.95; 2 -1.05,-0.95; 3 1.05,0
SOT230P700X170-4 = smd 1.86 x 0.898: 1 -3.075,2.3; 2 -3.075,0; 3 -3.075,-2.3 | smd 1.86 x 3.189: 4 3.075,0
SO08 = smd 0.6 x 2.2: 1 -1.905,-2.6; 2 -0.635,-2.6; 3 0.635,-2.6; 4 1.905,-2.6; 5 1.905,2.6; 6 0.635,2.6; 7 -0.635,2.6; 8 -1.905,2.6
SSOP28 = smd 0.4 x 1.5: 1 -4.225,-3.625; 2 -3.575,-3.625; 3 -2.925,-3.625; 4 -2.275,-3.625; 5 -1.625,-3.625; 6 -0.975,-3.625; 7 -0.325,-3.625; 8 0.325,-3.625; 9 0.975,-3.625; 10 1.625,-3.625; 11 2.275,-3.625; 12 2.925,-3.625; 13 3.575,-3.625; 14 4.225,-3.625; 15 4.225,3.625; 16 3.575,3.625; 17 2.925,3.625; 18 2.275,3.625; 19 1.625,3.625; 20 0.975,3.625; 21 0.325,3.625; 22 -0.325,3.625; 23 -0.975,3.625; 24 -1.625,3.625; 25 -2.275,3.625; 26 -2.925,3.625; 27 -3.575,3.625; 28 -4.225,3.625
ATBS-ADC = smd 0.7 x 0.25: 1 -2.4,1.75; 2 -2.4,1.25; 3 -2.4,0.75; 4 -2.4,0.25; 5 -2.4,-0.25; 6 -2.4,-0.75; 7 -2.4,-1.25; 8 -2.4,-1.75; 17 2.4,-1.75; 18 2.4,-1.25; 19 2.4,-0.75; 20 2.4,-0.25; 21 2.4,0.25; 22 2.4,0.75; 23 2.4,1.25; 24 2.4,1.75 | smd 0.25 x 0.7: 9 -1.75,-2.4; 10 -1.25,-2.4; 11 -0.75,-2.4; 12 -0.25,-2.4; 13 0.25,-2.4; 14 0.75,-2.4; 15 1.25,-2.4; 16 1.75,-2.4; 25 1.75,2.4; 26 1.25,2.4; 27 0.75,2.4; 28 0.25,2.4; 29 -0.25,2.4; 30 -0.75,2.4; 31 -1.25,2.4; 32 -1.75,2.4
LFSPXO009682REEL_IQD = smd 0.686 x 0.787: 1 -0.66,0.813; 2 -0.66,-0.813; 3 0.66,-0.813; 4 0.66,0.813
AK500/2 = drill 1.321 long: 1 -2.515,0; 2 2.515,0
BNC = drill 2.2: 3 -5.08,5.08; 4 5.08,5.08 | drill 0.8 long: GND -2.54,0; S 0,0
AUDIO-JACK-3.5MM-SMD = smd 2 x 2.5: RING 4.3,3.45; SLEEVE 2.4,-3.45; TIP 11.7,-3.45 | smd 1.2 x 2.5: RSH 1.5,3.45 | smd 2.5 x 2: TSH 15.75,0.75 | hole 2: 3.5,0; 10.5,0
1X04 = drill 1.016 long: 1 -3.81,0; 2 -1.27,0; 3 1.27,0; 4 3.81,0
CONN5_USB1734035_TEC = smd 0.508 x 2.311: 1 -1.6,4.461; 2 -0.8,4.461; 3 0,4.461; 4 0.8,4.461; 5 1.6,4.461 | smd 2.007 x 2.489: 6 -4.45,4.366; 7 4.45,4.366; 8 -4.45,-1.145; 9 4.45,-1.145 | drill 0.889 pad 0.889: 10 -2.21,1.854; 11 2.21,1.854

### Placement (x,y rotation side)
C1  32,75.5 0 top
C2  41.25,75.5 0 top
C3  50.5,75.5 0 top
C4  59.75,75.5 0 top
C5  14.5,82.25 270 top
C6  19.25,84 270 top
C7  22.25,80.5 270 top
C8  32,69.5 0 top
C9  41.25,69.5 0 top
C10  50.5,69.5 0 top
C11  59.75,69.5 0 top
C12  33.75,80.5 270 top
C13  21,36 180 bottom
C14  21,47.75 180 bottom
C15  19.25,69 270 top
C16  75.25,69 270 top
C17  15.25,67.5 0 top
C18  71.43,67.51 0 top
C19  21,17.25 180 bottom
C20  21,58.75 180 bottom
C21  75.25,81 180 top
C22  87.5,62.5 180 top
C23  81.75,16.25 180 bottom
C24  77,16.25 180 bottom
C25  72.25,16.25 180 bottom
C26  84.25,63.5 270 top
C27  67.25,16.25 0 bottom
C28  62.5,16.25 0 bottom
C29  57.75,16.25 0 bottom
C30  28,25 270 top
C31  88.5,37.75 270 top
C32  45.25,52.5 180 bottom
C33  75.25,38.5 180 top
C34  45.25,52.5 180 top
C35  85.25,43.25 0 top
C36  48.5,52.5 180 top
C37  51.5,52.5 0 top
C38  84.75,46.25 90 top
C39  54.75,52.5 0 top
C40  88.25,46.25 90 top
D1  38,45.5 0 bottom
D2  38,40.75 0 bottom
D3  38,55.25 180 bottom
D4  38,50.5 180 bottom
D5  90,28.25 180 top
D6  90,23.25 180 top
D7  90,18.25 180 top
D8  62,41 0 bottom
D9  62.25,36 270 bottom
D10  57.5,36 270 bottom
D11  62,45.5 0 bottom
D12  52.5,36 270 bottom
D13  42.75,36 90 bottom
D14  47.5,36 90 bottom
D15  62,50.5 180 bottom
D16  38,36 90 bottom
D17  92.25,52.75 0 top
D18  92.25,56.25 0 top
JP1  31.25,64 270 top
JP2  40.5,64 270 top
JP3  49.75,64 270 top
JP4  59,64 270 top
JP5  27.25,64 90 top
JP6  36.5,64 90 top
JP7  45.75,64 90 top
JP8  55,64 90 top
JP9  10.75,64.25 0 top
JP10  67,64.25 0 top
JP11  10.75,60.25 180 top
JP12  67,60.25 180 top
JP13  91.25,64.5 270 top
JP15  84.25,72.25 90 top
L1  28,85 0 top
L2  85.25,38.5 180 top
R1  22.25,84 270 top
R2  33.75,84 270 top
R3  24,38.5 270 bottom
R4  24,35 270 bottom
R5  24,50.25 270 bottom
R6  24,46.75 270 bottom
R7  34,46.5 0 bottom
R8  34,49.5 0 bottom
R9  24,20.25 270 bottom
R10  24,16.25 270 bottom
R11  24,61.25 270 bottom
R12  24,57.75 270 bottom
R13  34,41.75 0 bottom
R14  34,54.25 0 bottom
R15  93.75,28.25 180 top
R16  93.75,23.25 180 top
R17  81.75,81 0 top
R18  66,41.75 180 bottom
R19  61.25,31.75 270 bottom
R20  56.5,31.75 270 bottom
R21  66,46.5 180 bottom
R22  93.75,18.25 180 top
R23  81.75,20.5 180 bottom
R24  77,20.5 180 bottom
R25  72.25,20.5 180 bottom
R26  51.5,32 270 bottom
R27  67.25,20.5 0 bottom
R28  62.5,20.6 0 bottom
R29  43.75,32 270 bottom
R30  57.75,20.5 0 bottom
R31  66,49.5 180 bottom
R32  48.5,32 270 bottom
R33  38.75,32 270 bottom
R34  81.5,38.5 0 top
R35  72.25,51.25 90 top
R36  72.25,46.5 270 top
R37  88.25,52.75 0 top
R38  88.25,56.25 0 top
S1  78.5,85.75 180 top
S2  69.75,7.5 0 top
S3  78.5,32.25 0 top
TP1  40.5,86.75 0 top
TP2  17,36 0 top
TP3  17,47.5 0 top
TP4  28,36 0 top
TP5  28,47.75 0 top
TP6  17,17.25 0 top
TP7  17,58.75 0 top
TP8  28,17.25 0 top
TP9  28,58.75 0 top
TP10  41.26,25.91 0 top
TP11  25.75,28.5 0 top
TP12  84.25,66.75 270 top
TP13  72.25,54.75 0 top
TP14  72.25,43 0 top
TP15  45.5,13.75 0 top
U1  32,72.5 0 top
U2  41.25,72.5 0 top
U3  50.5,72.5 0 top
U4  59.75,72.5 0 top
U5  14.5,73 90 top
U6  70.5,73 90 top
U7  33.75,27.75 90 top
U8  78.5,46 270 top
U9  50,48 270 top
U10  87.5,65.25 270 top
U$1  [ESD_10.00]  15,2.25 0 top
U$2  [ESD_10.00]  25.25,2.25 0 bottom
U$3  [MUELLTONNE_10.00]  80.75,2.25 0 top
U$4  [MUELLTONNE_10.00]  91.75,2.25 0 bottom
X1  6.25,76.25 270 top
X2  11,36 90 top
X3  11,17.25 90 top
X4  0.25,53.24 0 top
X5  91.25,72.25 270 top
X6  34.5,10.5 0 top
X7  95.89,41.82 90 top
X8  48,10.5 0 top

### Tracks (layer width: path | path; a pad name or v marks a point on that pad's centre or on a via)
ADAPTIVE_MODE
  Bottom 0.508: S2.11 65.94,12.56 63.42,15.08 63.38,15.12 C28.1 63.38,20.55 R28.1 63.42,23.08 63.38,23.12 62.5,24 49.25,24 48.5,24.75 R32.2
ADAPTIVE_MODE_ESD  (via drill 0.35)
  Top 0.254: v49.5,42.75 49.5,43.55 50.25,44.3 U9.21
  Bottom 0.508: v49.5,42.75 49.5,41.5 48.6,40.6 48.6,37.25 D14.3 48.6,33.02 R32.1
BNC+_DC
  Bottom 0.508: R3.2 24,36 | 24,36 R4.1 21.96,35.92 C13.2 | 24,36 TP4.TP 28,42.75 31.75,46.5 R7.2
BNC+_ESD  (via drill 0.35)
  Top 0.254: v45,46.5 45.75,46.5 46.5,47.25 U9.14
  Bottom 0.508: v45,46.5 44.9,46.6 D1.3 35.02,46.6 R7.1
BNC-_DC
  Bottom 0.508: R9.2 24,17.25 | 24,17.25 R10.1 23.92,17.25 C19.2 | 24,17.25 TP8.TP 28,31.75 33.08,36.83 R13.2
BNC-_ESD  (via drill 0.35)
  Top 0.2: 45.02,45 v45,45
  Top 0.254: 45.02,45 46.77,46.75 U9.15
  Bottom 0.508: v45,45 44.25,45 41.1,41.85 D2.3 35.02,41.85 R13.1
CLOCK_ESD  (via drill 0.35)
  Top 0.254: v55.25,50.75 54.5,50.75 53.5,49.75 U9.32
  Bottom 0.508: R31.1 64.98,49.4 D15.3 58.28,49.4 56.93,50.75 v55.25,50.75
CONTROL_MODE
  Bottom 0.508: S2.10 68.48,13.77 68.12,14.12 C27.1 68.17,16.29 R27.1 68.17,24.08 67.25,25 52.25,25 51.5,25.75 R26.2
CONTROL_MODE_ESD  (via drill 0.35)
  Top 0.254: U9.22 v50.75,42.75
  Bottom 0.508: v50.75,42.75 50.75,41.25 51.4,40.6 D12.3 51.4,33.02 R26.1
ECG+_DC
  Bottom 0.508: R11.2 24,58.75 | 24,58.75 R12.1 | 24,58.75 TP9.TP 28,55.25 29,54.25 R14.2 | C20.2 24,58.75
ECG+_ESD  (via drill 0.35)
  Top 0.254: v45,49.5 45.75,49.5 46.5,48.75 U9.11
  Bottom 0.254: 44.25,49.5 v45,49.5
  Bottom 0.406: D3.3 35.02,54.15 R14.1
  Bottom 0.508: D3.3 39.6,54.15 44.25,49.5
ECG-_DC
  Bottom 0.508: R8.2 31.75,49.5 30,47.75 TP5.TP 24,47.75 R5.2 R6.1 23.92,47.75 C14.2
ECG-_ESD  (via drill 0.35)
  Top 0.254: v45,48 46.25,48 46.5,48.25 U9.12
  Bottom 0.508: R8.1 37.9,49.5 D4.3 42.85,49.4 44.25,48 v45,48
ENABLE
  Bottom 0.508: S2.7 80.06,11.31 80.88,12.12 C23.1 80.83,16.29 R23.1 80.83,27.17 80,28 71,28 69.92,29.08 69.92,40.75 68.92,41.75 R18.2
ENABLE_ESD  (via drill 0.35)
  Top 0.254: v55.25,48.75 53.75,48.75 U9.30
  Bottom 0.508: R18.1 62.35,41.75 D8.3 60.9,42.1 58.65,42.1 58,42.75 58,44.25 58,46 v55.25,48.75
GND  (via drill 0.35)
  other vias: 22.25,78.25 11.75,77.5 17.25,77.5 19.25,81.75 33.75,78.25 34.5,75.5 34.5,72.5 34.5,69.5 43.75,75.5 43.75,72.5 43.75,69.5 53,75.5 53,72.5 53,69.5 62.25,75.5 62.25,72.5 62.25,69.5 73,81 97,48.25 97,35.5 91.5,35.5 73,38.5 86.75,67 55.5,16.25 60.25,16.25 64.75,16.25 74.75,16.25 79.25,16.25 84,16.25 36.25,31 24,23 24,14 24,32.5 24,44.5 24,55.5 36.25,57.75 36.25,53 40.25,34.5 45,34.5 63.5,43 56.75,52.5 61,53 53,54 47,54 19.25,66.75 12.25,72 52.5,39.75 91.5,48.25 66.25,70 50,39.75 47.5,39.75 40.75,44.5 40.75,48 75.25,66.75 70.5,78 73.5,76.25 90.5,44.5 86.5,47.75 90.5,39.25 80,43.25 77,43.25 80.25,48.25 78.12,46.12 60.5,48 97,20.75 97,25.75 65,39.75 65,37 84.25,61.25 49.25,49.25 49.25,46.75 51.25,48 76.75,57.75 82.5,57.75 86.25,40 31,23 59.75,29.25
  pour Top (isolate 0.254): 0,0 0,90 100,90 100,0
  pour Bottom (isolate 0.254): 0,0 0,90 100,90 100,0
IDLE_LED
  Top 0.2: 53.5,47.25
  Top 0.254: U9.27 53.5,47.25 | 53.5,47.25 58.5,42.25 58.5,41.75
  Top 0.508: 58.5,41.75 58.5,28.75 59.25,28 88.72,28 D5.A
LA
  Top 0.508: X4.RING 12.7,56.7 14.75,58.75 TP7.TP
  Bottom 0.508: C20.1 TP7.TP
LOWER
  Top 0.508: X6.3 35.77,13.73 33.75,15.75 33.75,26.5 33.13,27.11 U7.7 U7.6 25.86,28.39 TP11.TP
N$1
  Top 0.508: U2.2 40.38,71.38 C9.1 40.38,65.39 JP2.1
N$2
  Top 0.508: JP3.1 49.62,65.39 C10.1 49.62,71.38 U3.2
N$3
  Top 0.508: JP4.1 58.88,65.39 C11.1 58.88,71.38 U4.2
N$4
  Top 0.508: U6.2 70.56,69.87
  Top 0.61: JP10.1 65.73,66.73 66.51,67.51 C18.1 70.56,69.87
N$5
  Bottom 0.508: X3.S TP6.TP C19.1
N$6
  Top 0.508: D17.C R37.2
N$7
  Top 0.508: D18.C R38.2
N$8
  Top 0.508: 14.5,67.62 C17.1
  Top 0.61: U5.2 14.5,67.62 | C17.1 10.25,67.5 9.48,66.73 JP9.1
N$9
  Top 0.406: L2.1 86.44,38.62 C31.1 88.5,39.75 88.75,40 88.97,40.22 X7.1
N$10
  Top 0.508: X5.1 JP15.3
N$11
  Top 0.406: 78.5,38.5 78.5,38.75 78.5,43.63 79.24,44.38 U8.19 | 78.5,38.5 78.5,34.51 | C33.1 78.5,38.5 | 78.5,38.5 R34.1
  Top 0.61: S3.1 78.5,34.51 S3.2
N$13  (via drill 0.35)
  Top 0.508: JP15.2 79.25,72.25 78.5,71.5 v78.5,57.75
  Bottom 0.508: R31.2 70.25,49.5 75.75,49.5 78.5,52.25 v78.5,57.75
N$30
  Top 0.508: R2.2 C12.1
N$38
  Top 0.508: R1.2 C7.1
N$39
  Top 0.508: U10.1 91.11,65.91 JP13.1
N$40
  Bottom 0.508: X2.S TP2.TP C13.1
N$42
  Top 0.508: U1.2 31.23,71.55 31.12,71.45 C8.1 31.12,65.39 JP1.1
N$43
  Top 0.508: JP15.1 TP12.TP 84.25,64.5 | 84.25,64.5 C26.1 | U10.3 84.34,64.59 84.25,64.5
N$47
  Top 0.813: L1.1 25.48,84.92 R1.1 22.21,84.88 C6.1 15.03,84.88 C5.+ 10.65,85.4 10.25,85 6.25,81 X1.1
N$51
  Top 0.508: R15.2 D5.C
N$52
  Top 0.508: D6.C R16.2
N$54
  Top 0.508: D7.C R22.2
N$55
  Top 0.406: U8.1 72.36,50.23 R35.1
N$63
  Top 0.406: U8.5 72.46,47.62 R36.1
N$67
  Top 0.406: U8.17 84.2,43.08 C35.1
N$70
  Top 0.406: U8.23 80.03,46.98 79.25,47.75 79.25,52 80,52.75 R37.1
N$71
  Top 0.406: U8.16 80.67,42.42 80.25,42 80.25,41.5 80.73,41.02 X7.2
N$72
  Top 0.406: U8.15 91.38,41.77 X7.3
N$75
  Top 0.406: R38.1 79,56.25 78.25,55.5 78.25,47.38 79.3,46.33 U8.22
OVERFLOW_LED
  Top 0.254: 57,41.75 57,43 53.25,46.75 U9.26
  Top 0.508: D6.A 88.97,25.77 88.25,26.5 68,26.5 57.75,26.5 57,27.25 57,34 57,41.75
RA
  Top 0.508: TP3.TP 9.4,47.5 7.11,49.8 X4.SLEEVE
  Bottom 0.508: C14.1 19.88,47.5 TP3.TP
RESET_N  (via drill 0.35)
  Top 0.508: C21.1 78.5,81 | R17.1 78.5,81 | v80.75,57.75 v80.75,69.75 | v80.75,74.75 79.25,74.75 78.5,75.5 78.5,81 | 78.5,83.49 78.5,81
  Top 0.61: S1.2 78.5,83.49 S1.1
  Bottom 0.508: R21.2 70,46.5 75.5,46.5 80.75,51.75 v80.75,57.75 | v80.75,69.75 v80.75,74.75
RESET_N_ESD  (via drill 0.35)
  Top 0.254: v56,49.75 54.65,49.75 54.15,49.25 U9.31
  Bottom 0.508: v56,49.75 59.15,46.6 D11.3 64.98,46.6 R21.1
SELECT_TBS_DELTA_STEPS
  Bottom 0.508: S2.8 73.56,12.56 76.12,15.12 C24.1 76.08,16.29 R24.1 76.08,26.17 75.25,27 62,27 61.25,27.75 R19.2
SELECT_TBS_DELTA_STEPS_ESD  (via drill 0.35)
  Top 0.254: v54.25,42.75 51.75,45.25 U9.24
  Bottom 0.508: v54.25,42.75 54.25,42 54.25,41.5 57.25,38.5 57.75,38.5 59.25,38.5 59.5,38.5 61,37 61.15,36.85 D9.3 61.25,35.9 61.25,35 R19.1
SIGNAL_SELECT_IN
  Bottom 0.508: S2.9 71.02,13.77 71.33,14.08 R25.1 71.38,20.46 C25.1 71.38,25.12 70.5,26 57,26 56.5,26.5 R20.2
SIGNAL_SELECT_IN_ESD  (via drill 0.35)
  Top 0.254: v52.5,42.75 52.5,43.1 51.25,44.35 U9.23
  Bottom 0.508: v52.5,42.75 52.5,41.4 56.4,37.5 D10.3 56.4,32.77 R20.1
TRIGGER_START_MODE
  Bottom 0.508: S2.12 59.44,11.31 58.62,12.12 C29.1 58.67,16.29 R30.1 58.67,22.08 57.75,23 44.5,23 43.75,23.75 R29.2
TRIGGER_START_MODE_ESD  (via drill 0.35)
  Top 0.254: v47.75,42.75 48.05,42.75 49.75,44.45 U9.20
  Bottom 0.508: v47.75,42.75 47.75,41.65 43.85,37.75 43.85,37 D13.3 43.85,34.5 43.85,33.02 R29.1
TRIGGER_START_SAMPLING
  Top 0.508: TP15.TP 45.46,13.71 X8.1
  Bottom 0.508: R33.2 38.75,21 39.5,20.25 44.5,20.25 45.5,19.25 TP15.TP
TRIGGER_START_SAMPLING_ESD  (via drill 0.35)
  Top 0.254: v46,42.75 46.75,43.5 47.96,43.5 49.25,44.79 U9.19
  Bottom 0.406: D16.3 39.1,33.27 R33.1
  Bottom 0.508: D16.3 39.1,37.1 42.03,40.03 43.28,40.03 v46,42.75
UART_RX
  Top 0.2: U9.29 52.75,48.25
  Top 0.254: 52.75,48.25 54.12,48.25 54.62,47.75 57.25,47.75
  Top 0.508: R35.2 TP13.TP 59.25,54.75 58.75,54.25 58.75,49.5 58.75,48.25 58.25,47.75 57.25,47.75
UART_TX
  Top 0.2: U9.28 52.75,47.75
  Top 0.254: 52.75,47.75 53.75,47.75 54.8,46.7 55.25,46.25 57.25,46.25
  Top 0.508: 57.25,46.25 61.5,46.25 62.5,47.25 62.5,52.75 63,53.25 69.25,53.25 69.75,52.75 69.75,52 69.75,46 70,45.75 70.17,45.58 R36.2 TP14.TP
UNDERFLOW_LED
  Top 0.254: U9.25 53,46.25 55.5,43.75 55.5,41.75
  Top 0.508: D7.A 85.25,18.25 84.5,19 84.5,24.25 83.75,25 68.25,25 56.25,25 55.5,25.75 55.5,26.25 55.5,35.25 55.5,41.75
UPPER  (via drill 0.35)
  Top 0.508: TP10.TP 41.19,25.84 U7.1 | v36.25,24 36.25,25.75 U7.1 | U7.2 U7.1
  Bottom 0.508: X6.1 30.69,13.94 30.69,19.44 31.5,20.25 35.5,20.25 36.25,21 v36.25,24
VDAC_LOWER
  Top 0.254: 44.75,43.75 45,43.75 45.7,44.45 47.48,44.45 48.25,45.23 U9.17
  Top 0.305: 43.75,43.75 44.75,43.75
  Top 0.508: 43.75,43.75 42.25,43.75 41.25,42.75 31.15,32.65 U7.5
VDAC_UPPER
  Top 0.254: U9.18 48.75,45.04 47.69,43.98 45.98,43.98 44,42
  Top 0.305: 44,42 43,42
  Top 0.508: U7.3 34.37,28.39 33.75,29 33.75,31.12 33.75,33 42.25,41.5 42.75,42 43,42
VDD
  Top 0.508: U3.1 49.73,73.45 49.62,73.55 C3.1 49.62,76.88 49.75,77 | C15.1 19.2,69.92 | 31.23,77 31.12,76.9 C1.1 31.12,73.62 U1.1 | 58.98,77 58.88,76.9 C4.1 58.88,73.62 U4.1 | U2.1 40.38,73.62 C2.1 40.38,76.88 40.5,77 40.5,77.25 | 72.85,69.88 U6.3
  Top 0.61: C15.1 19.25,76 20.25,77 31.23,77 40.5,77 49.75,77 58.98,77 63,77 63.75,76.25 63.75,73.75 64.48,73.02 74.48,73.02 75,72.5 75.25,72.25 C16.1 72.85,69.88 | 19.2,69.92 U5.3
  Top 0.813: TP1.TP 40.5,85 | 40.5,85 33.83,85 R2.1 33.67,85 L1.2 | 40.5,85 40.5,77.25
VDD_AMP
  Top 0.2: C34.1 46,52.48
  Top 0.254: 46,52.48 46,51.75 46.6,51.15 48,51.15 48.25,50.9 U9.8
  Top 0.406: JP1.2 JP5.1
  Top 0.508: JP1.2 31.25,59.73 31.95,59.03 40.28,59.03 45.22,59.03 46,58.25 46,53.75 46.02,53.73 46.02,52.98 C34.1
VDD_COMP
  Top 0.2: 49.25,52.48 C36.1
  Top 0.254: U9.6 49.25,52.48
  Top 0.508: JP2.2 40.5,61.25 41.25,60.5 46.75,60.5 47.75,59.5 47.75,55 49.27,53.48 C36.1
  Bottom 0.406: JP6.1 JP2.2
VDD_DAC
  Top 0.254: C37.1 50.73,51.73 50.25,51.25 U9.4
  Top 0.508: JP3.2 49.75,55.25 50.73,54.27 C37.1
  Bottom 0.406: JP7.1 JP3.2
VDD_DIG
  Top 0.254: C39.1 53.98,51.75 53.48,51.25 51.52,51.25 51.25,50.98 U9.2
  Top 0.508: JP8.1 55,55.22 55,55.12 53.98,54.1 C39.1
  Bottom 0.406: JP8.1 JP4.2
VDD_EXT  (via drill 0.5)
  Top 0.406: U8.4 76.47,48.27 77,47.75 77,45.5 77.47,45.02 U8.20 84.4,45.02 C38.1
  Top 0.508: v21.75,51.25 v21.75,39.5 | 27.88,25.75 C30.1 28,25.91 28.07,25.84 U7.8 | D17.A 93.25,52.77 | 93.28,54.52 v93.25,54.5 | 68.27,38.27 v68.25,38.25 | v84,81 R17.2 | 84.18,39.94 v84.12,40 | C22.1 88.31,62.56 88.25,62.5
  Top 0.61: v21.75,62.25 v21.75,51.25 | 21.75,25.75 v21.75,39.5 v35,39.5 v35,44.25 35,51.5 | 21.75,25.75 v21.75,21.25 | v82.5,18.75 v77.75,18.75 v74.75,18.75 v64.75,18.75 v61.5,18.75 v56.75,18.75 54.25,18.75 54,19 53.62,19.38 v53.62,33.25 46.5,33.25 | 35,51.5 35,55.5 35.75,56.25 v40.5,56.25 v44,56.25 | 35,51.5 v40.25,51.5 | 46.5,33.25 v46.5,38.25 | 42.5,33.25 v42.5,38.25 | v36.25,33.25 41.75,33.25 42.5,33.25 | 46.5,33.25 42.5,33.25 | 27.88,25.75 21.75,25.75 | v68.27,51.62 68.27,44.5 | 68.27,44.5 68.27,39.75 68.27,38.27 | R34.2 L2.2 84.18,39.94 | 93.25,52.77 v93.25,54.5 | D18.A 93.28,54.52 | v60,34.25 60,33.75 60.5,33.25 67.75,33.25 68.25,33.75 v68.25,35 v68.25,38.25 | v88.25,43.25 C40.1 C38.1 | U10.4 88.31,62.56 | v88.25,59.38 88.25,62.5 | v59.75,44.5 68.27,44.5
  Bottom 0.508: 23.92,21.25 R9.1 | 56.83,18.83 v56.75,18.75 | v82.5,18.75 82.67,18.92 | 77.92,18.92 v77.75,18.75 | v74.75,18.75 74.75,20 74.25,20.5 R25.2 | R27.2 65.25,20.5 64.75,20 v64.75,18.75 | 61.58,18.83 v61.5,18.75 | v53.62,33.25 53.6,33.27 | 39.05,51.5 D4.2 | 36.9,44.25 D1.2 | 46.5,37.05 D14.2 | D11.2 60.92,44.52 | v59.75,44.5 59.77,44.52 | 35.05,36.95 35,37 | 68.2,35.05 v68.25,35 | JP12.1 68.27,59.38 | v68.27,51.62 68.25,51.6 v68.27,51.62
  Bottom 0.61: R11.1 21.83,62.17 v21.75,62.25 | v21.75,21.25 23.92,21.25 | R3.1 21.83,39.42 v21.75,39.5 | R5.1 21.83,51.17 v21.75,51.25 | R30.2 56.83,18.83 | 82.67,18.92 R23.2 | R24.2 77.92,18.92 | R28.2 61.58,18.83 | 53.6,33.27 D12.2 | v40.25,51.5 39.05,51.5 | v35,44.25 36.9,44.25 | v46.5,38.25 46.5,37.05 | v42.5,38.25 42.2,38.25 41.65,37.7 D13.2 | v36.25,33.25 35.75,33.25 35,34 35,37 | 60.92,44.52 59.77,44.52 | D16.2 35.05,36.95 35,37 | JP10.2 JP12.1 68.27,56.75 68.27,56.25 | 68.25,51.6 D15.2 | 68.27,56.25 v68.27,51.62 | 88.25,54.5 v88.25,59.38 78.5,59.38 | 88.25,54.5 v88.25,43.25 84.75,43.25 84.12,42.62 v84.12,40 | 88.25,54.5 v93.25,54.5 | D8.2 61.05,38.7 61.5,38.25 v68.25,38.25 | 68.27,56.25 v44,56.25 | D10.2 59.45,35.05 60,34.5 v60,34.25 | D9.2 68.2,35.05 | 68.27,59.38 78.5,59.38 | 78.5,59.38 78.5,80.25 79.25,81 v84,81 | D2.2 36.9,39.5 v35,39.5 35,37 | v40.5,56.25 39.05,56.25 D3.2
VDD_IO  (via drill 0.5)
  Top 0.254: v45.25,51 46.5,49.75 U9.9
  Top 0.61: v28.75,60.75 24.75,60.75 23.75,61.75 v23.75,64.25
  Bottom 0.508: 12.11,64.25 12.02,64.34 JP9.2 | 44.5,51.75 44.48,51.77 | 44.45,52.48 C32.1
  Bottom 0.61: v28.75,60.75 41.25,60.75 42.25,59.75 42.25,53.73 43.5,52.48 44.45,52.48 | v45.25,51 44.5,51.75 | v23.75,64.25 12.11,64.25 | JP11.1 12.02,64.34 | 44.48,51.77 C32.1

### Text on the board
SilkscreenTop: ATBS ASIC Evaluation Board / by S. Dorrer @ JKU, ISP / 12.2024 | 1 | 2 | 3 | 4 | 5 | 6
SilkscreenBottom: ATBS ASIC Evaluation Board / by S. Dorrer @ JKU, ISP / 12.2024
NamesTop: +5V | RESET / ASIC | +5V | CLK_SEL | GND | EXT. CLK | GND | GND | AMP_U | COMP_U | DAC_U | DIG_U | XTAL | IO_I | EXT_I | XTAL_EN | IO_U | ECG+ | AMP_I | COMP_I | DAC_I | DIG_I | EXT_U | ECG+_DC | UART_RX | RX_LED | TX_LED | ECG- | ECG-_DC | ATBS ASIC | UART_TX | BNC+ | BNC+_DC | DAC_LOWER | RESET / FT232 | DAC_UPPER | IDLE | OVERFLOW | BNC- | BNC-_DC | UNDERFLOW | TRIGGER_START_MODE | ADAPTIVE_MODE | CONTROL_MODE | SIGNAL_SELECT_IN | SELECT_TBS_Δ_STEPS | ENABLE | GND | GND | GND | GND | TRIGGER | DAC_UPPER | DAC_LOWER